# Altium project master.PrjPcb (part 2 of 4)

## Sheet analog_supply_decoupling.SchDoc
size A3; DocumentNumber: 7; SheetNumber: 7; SheetTotal: 24; SheetDescription: Analog Supply Decoupling
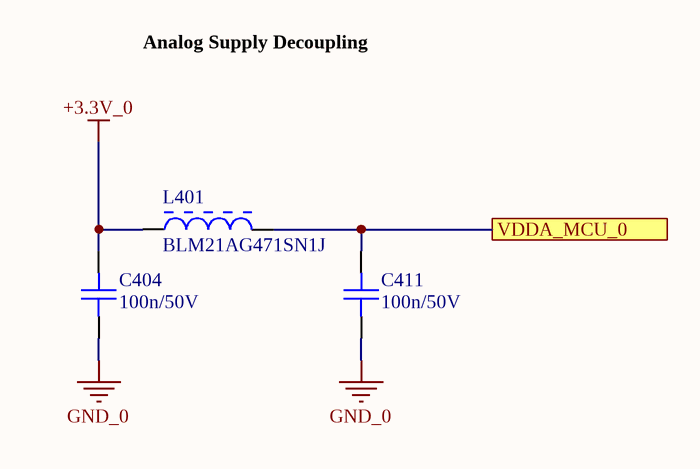
[diagram p10: analog_supply_decoupling.SchDoc]

### Parts
C404  100n/50V  [CAPC1608X08N]
C411  100n/50V  [CAPC1608X08N]
L401  BLM21AG471SN1J  [MURA-BLM21-H1-CHIP-2_V]

### Ports
VDDA_MCU_0

### Nets
+3.3V_0: C404.1 L401.1
GND_0: C404.2 C411.2
VDDA_MCU_0: C411.1 L401.2 ; port VDDA_MCU_0

### Notes on the sheet
- Analog Supply Decoupling
- Fraunhofer IISB
- Schottkystr. 10
- developed by:
- 91058 Erlangen
- Germany
- Author
- Project
- License
- Description
- File
- Version
- Release Date
- Sheet
- www.foxbms.org
- www.iisb.fraunhofer.de
- foxBMS Team
- /

### Library data of the parts
C404 C411 = gen_C_ceramic_100n_50V_X7R_0603: as C2101 on sheet FPGA_SPI_interface; Part Number: gen_C_ceramic_100n_50V_X7R_0603; Supplier 1: Farnell; Supplier Part Number 1: 2525267; Supplier 2: Digikey; Supplier Part Number 2: 490-6049-1-ND
L401 = CMP-0686-00649-2: Chip Ferrite Bead for General Signal lines, 470 Ohm, 700 mA, -55 to 125 degC, 2 x 1.25 x 1.05 mm SMD, Tape and Reel; Manufacturer: Murata; DC Resistance: 0.19 Ohm Max.; Impedance (at 100 MHz): 470 Ohm +/- 25%; Rated Current: 700 mA; ComponentLink1URL: http://www.murata.com/; Packing: Tape and Reel; PackageDescription: 2-Pin Chip, Body 2 x 1.25 mm; ComponentLink3Description: Package Specification; Operating Temperature Range: -55 to 125 degC; ComponentLink1Description: Manufacturer URL; PartNumber: BLM21AG471SN1J; DatasheetVersion: 08/2013; Mounting Technology: Surface Mount; ComponentLink2URL: http://www.murata.com/products/catalog/pdf/c31e.pdf; ComponentLink3URL: http://www.murata.com/products/catalog/pdf/c31e.pdf; ComponentLink2Description: Datasheet; PackageReference: BLM21_H1050-2

## Sheet SDRAM.SchDoc: foxBMS BMS-Master
size A3; DocumentNumber: 22; SheetNumber: 22; SheetTotal: 24; Author: Fraunhofer IISB foxBMS Team; REL-DATE: 2017-05-16; VERSION: 1.0.2; SheetDescription: 8MB SDRAM
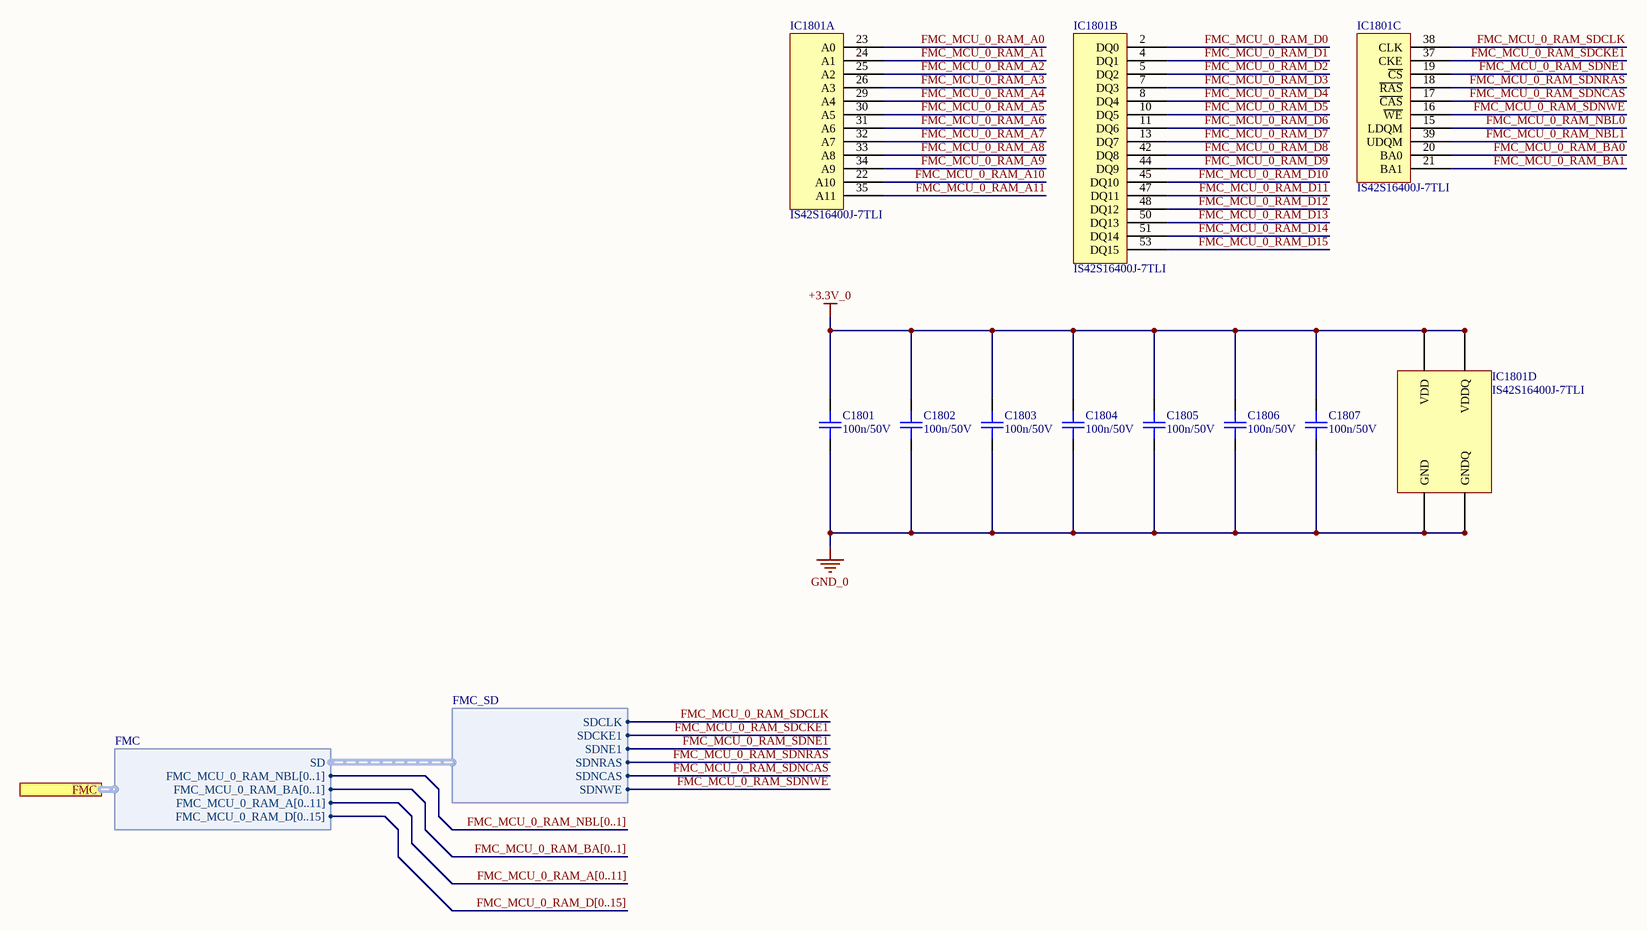
[diagram p11: SDRAM.SchDoc]

### Parts
C1801  100n/50V  [CAPC1608X08N]
C1802  100n/50V  [CAPC1608X08N]
C1803  100n/50V  [CAPC1608X08N]
C1804  100n/50V  [CAPC1608X08N]
C1805  100n/50V  [CAPC1608X08N]
C1806  100n/50V  [CAPC1608X08N]
C1807  100n/50V  [CAPC1608X08N]
IC1801  IS42S16400J-7TLI  [TSOP80P1180X120-54N]  (parts A,B,C,D of 4)

### Ports
FMC (harness FMC)

### Harnesses
FMC_SD: SDCLK, SDCKE1, SDNE1, SDNRAS, SDNWE, SDNCAS
FMC: SD, FMC_MCU_0_RAM_NBL[0..1], FMC_MCU_0_RAM_BA[0..1], FMC_MCU_0_RAM_A[0..11], FMC_MCU_0_RAM_D[0..15]

### Nets
+3.3V_0: C1801.1 C1802.1 C1803.1 C1804.1 C1805.1 C1806.1 C1807.1 IC1801.1(VDD) IC1801.3(VDDQ) IC1801.9(VDDQ) IC1801.14(VDD) IC1801.27(VDD) IC1801.43(VDDQ) IC1801.49(VDDQ)
GND_0: C1801.2 C1802.2 C1803.2 C1804.2 C1805.2 C1806.2 C1807.2 IC1801.6(GNDQ) IC1801.12(GNDQ) IC1801.28(GND) IC1801.41(GND) IC1801.46(GNDQ) IC1801.52(GNDQ) IC1801.54(GND)
FMC_MCU_0_RAM_A0: IC1801.23(A0)
FMC_MCU_0_RAM_A1: IC1801.24(A1)
FMC_MCU_0_RAM_A2: IC1801.25(A2)
FMC_MCU_0_RAM_A3: IC1801.26(A3)
FMC_MCU_0_RAM_A4: IC1801.29(A4)
FMC_MCU_0_RAM_A5: IC1801.30(A5)
FMC_MCU_0_RAM_A6: IC1801.31(A6)
FMC_MCU_0_RAM_A7: IC1801.32(A7)
FMC_MCU_0_RAM_A8: IC1801.33(A8)
FMC_MCU_0_RAM_A9: IC1801.34(A9)
FMC_MCU_0_RAM_A10: IC1801.22(A10)
FMC_MCU_0_RAM_A11: IC1801.35(A11)
FMC_MCU_0_RAM_BA0: IC1801.20(BA0)
FMC_MCU_0_RAM_BA1: IC1801.21(BA1)
FMC_MCU_0_RAM_D0: IC1801.2(DQ0)
FMC_MCU_0_RAM_D1: IC1801.4(DQ1)
FMC_MCU_0_RAM_D2: IC1801.5(DQ2)
FMC_MCU_0_RAM_D3: IC1801.7(DQ3)
FMC_MCU_0_RAM_D4: IC1801.8(DQ4)
FMC_MCU_0_RAM_D5: IC1801.10(DQ5)
FMC_MCU_0_RAM_D6: IC1801.11(DQ6)
FMC_MCU_0_RAM_D7: IC1801.13(DQ7)
FMC_MCU_0_RAM_D8: IC1801.42(DQ8)
FMC_MCU_0_RAM_D9: IC1801.44(DQ9)
FMC_MCU_0_RAM_D10: IC1801.45(DQ10)
FMC_MCU_0_RAM_D11: IC1801.47(DQ11)
FMC_MCU_0_RAM_D12: IC1801.48(DQ12)
FMC_MCU_0_RAM_D13: IC1801.50(DQ13)
FMC_MCU_0_RAM_D14: IC1801.51(DQ14)
FMC_MCU_0_RAM_D15: IC1801.53(DQ15)
FMC_MCU_0_RAM_NBL0: IC1801.15(LDQM)
FMC_MCU_0_RAM_NBL1: IC1801.39(UDQM)
FMC_MCU_0_RAM_SDCKE1: IC1801.37(CKE) ; harness FMC_SD.SDCKE1
FMC_MCU_0_RAM_SDCLK: IC1801.38(CLK) ; harness FMC_SD.SDCLK
FMC_MCU_0_RAM_SDNCAS: IC1801.17(~{CAS}) ; harness FMC_SD.SDNCAS
FMC_MCU_0_RAM_SDNE1: IC1801.19(~{CS}) ; harness FMC_SD.SDNE1
FMC_MCU_0_RAM_SDNRAS: IC1801.18(~{RAS}) ; harness FMC_SD.SDNRAS
FMC_MCU_0_RAM_SDNWE: IC1801.16(~{WE}) ; harness FMC_SD.SDNWE

### Buses and harness runs
bus FMC_MCU_0_RAM_A[0..11]
bus FMC_MCU_0_RAM_BA[0..1]
bus FMC_MCU_0_RAM_D[0..15]
bus FMC_MCU_0_RAM_NBL[0..1]

### Notes on the sheet
- Fraunhofer IISB
- Schottkystr. 10
- developed by:
- 91058 Erlangen
- Germany
- Author
- Project
- License
- Description
- File
- Version
- Release Date
- Sheet
- www.foxbms.org
- www.iisb.fraunhofer.de
- foxBMS Team
- /

### Library data of the parts
C1801-C1807 = gen_C_ceramic_100n_50V_X7R_0603: as C2101 on sheet FPGA_SPI_interface; Part Number: gen_C_ceramic_100n_50V_X7R_0603; Supplier 1: Farnell; Supplier Part Number 1: 2525267; Supplier 2: Digikey; Supplier Part Number 2: 490-6049-1-ND
IC1801 = IS42S16400J-7TLI: SDRAM, 4M x 16 Bit; Manufacturer: INTEGRATED SILICON SOLUTION (ISSI); PnP Package: TSOP II; Automotive Qualified: True; Part Number: IS42S16400J-7TLI; Part Name: IS42S16400J-7TLI; Operating Temperature: -40 / o / C to +85 / o / -40°C - +85°C; ComponentLink1Description: Datasheet; ComponentLink1URL: http://www.farnell.com/datasheets/1674895.pdf; Supplier 1: Farnell; Supplier Part Number 1: 2253831

## Sheet CAN0.SchDoc: foxBMS BMS-Master
size A3; DocumentNumber: 14; SheetNumber: 14; SheetTotal: 24; Author: Fraunhofer IISB foxBMS Team; REL-DATE: 2017-05-16; VERSION: 1.0.2; SheetDescription: CAN0 Interface for MCU0
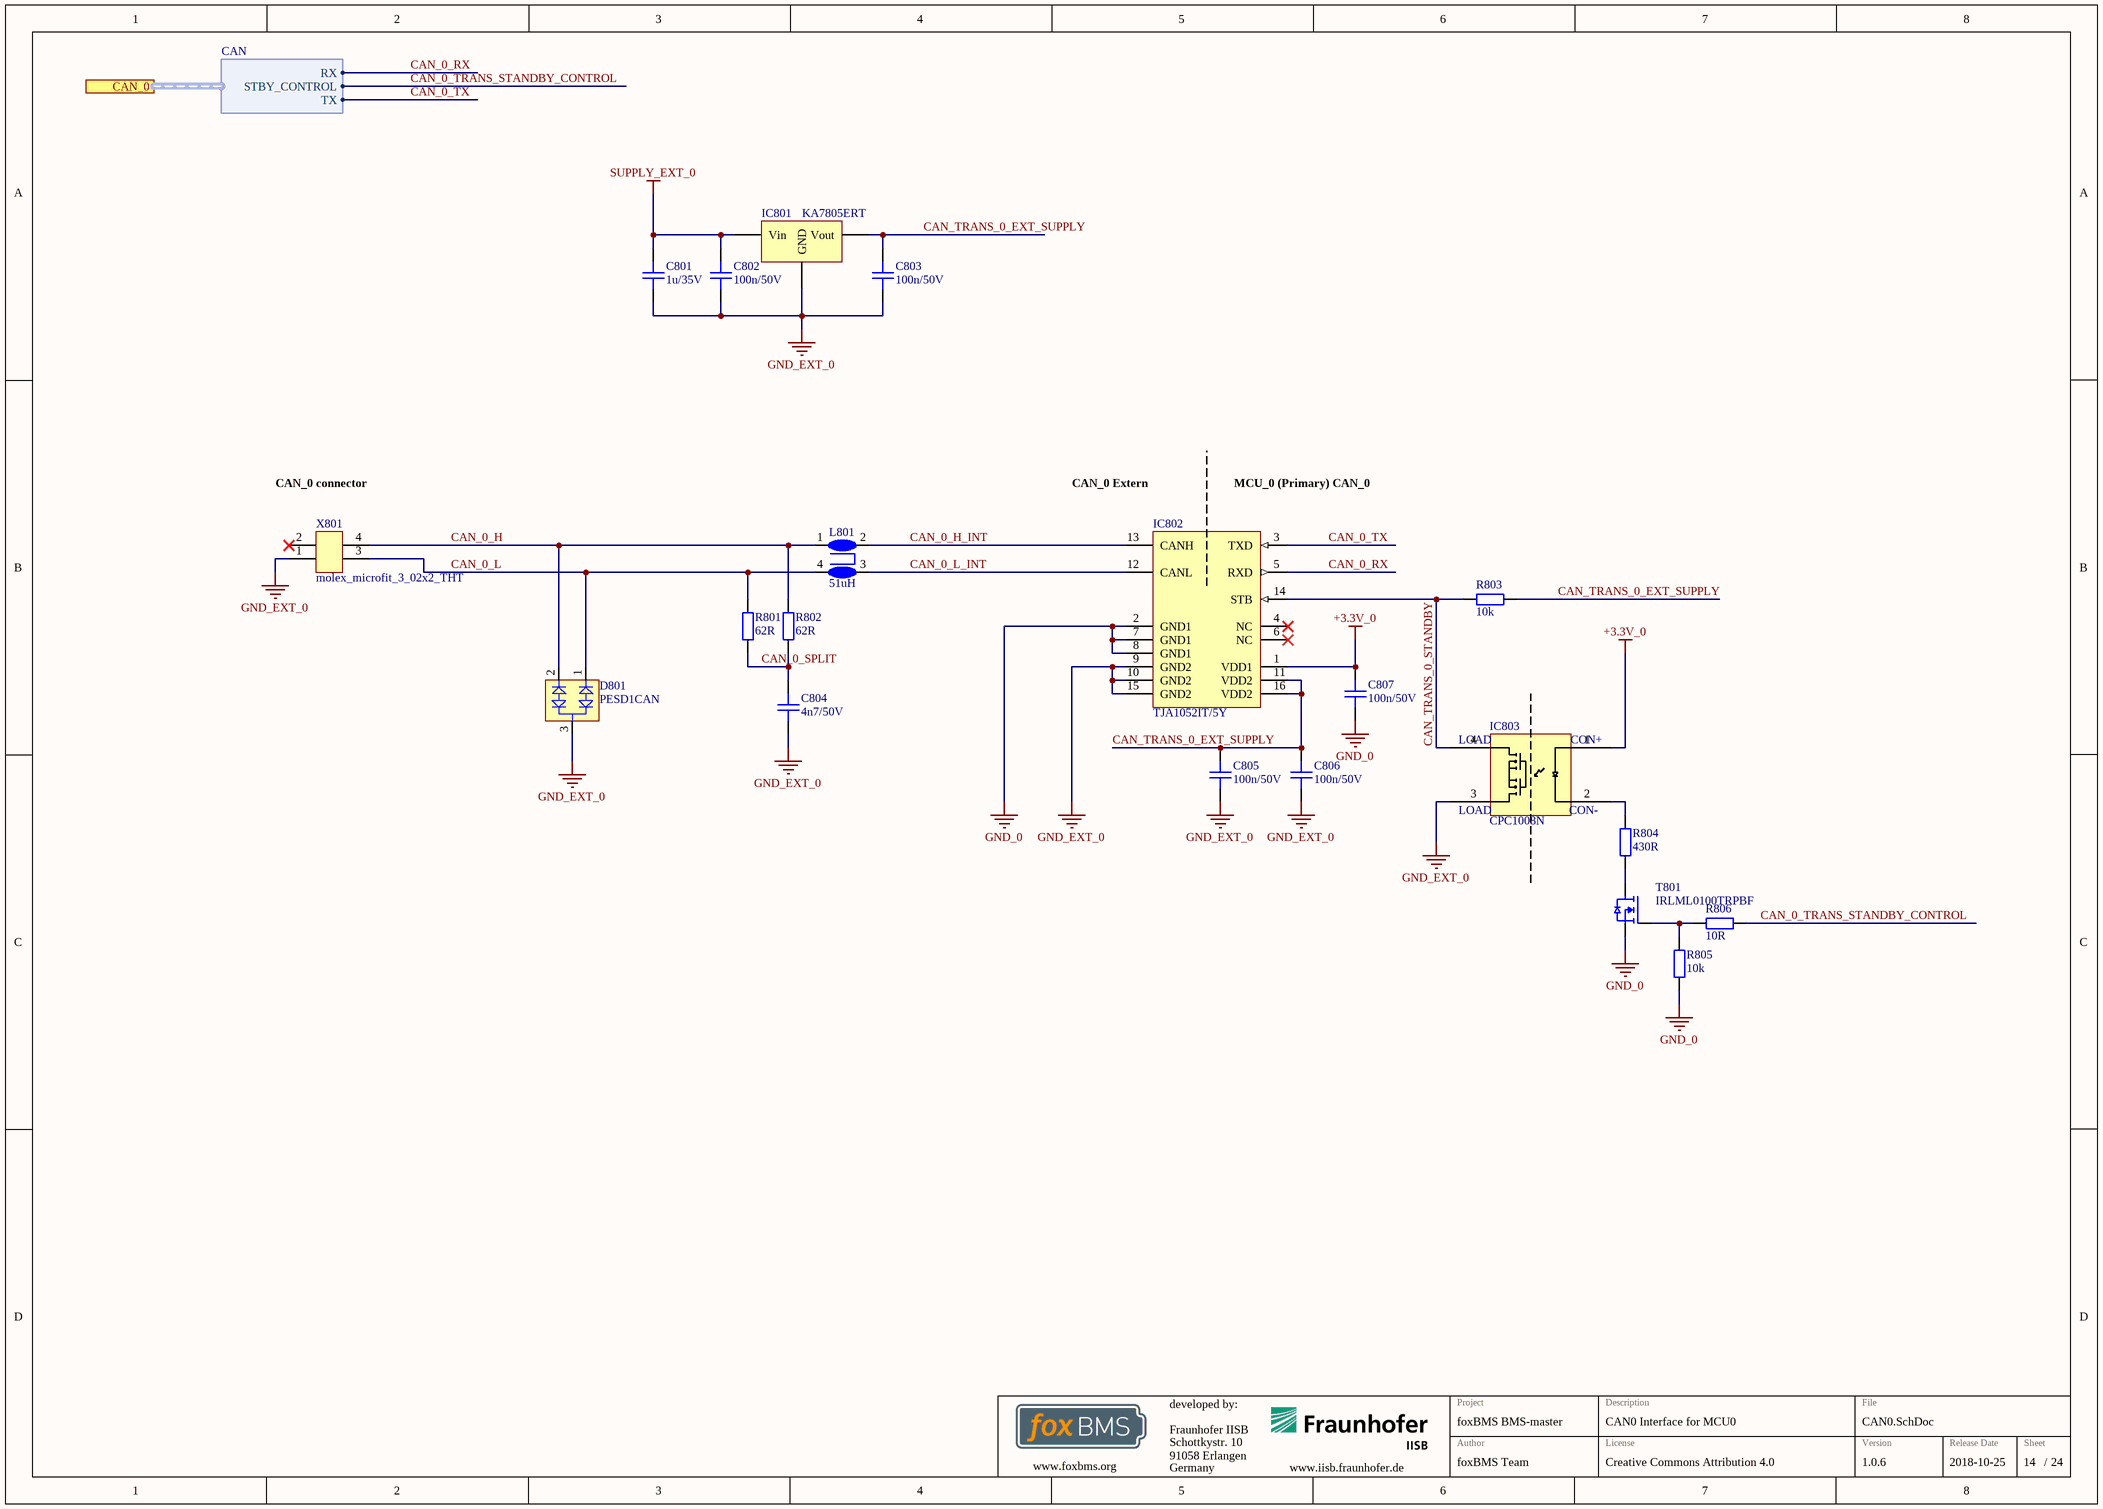
[diagram p12: CAN0.SchDoc]

### Parts
C801  1u/35V  [CAPC1608X08N]
C802  100n/50V  [CAPC1608X08N]
C803  100n/50V  [CAPC1608X08N]
C804  4n7/50V  [CAPC1608X08N]
C805  100n/50V  [CAPC1608X08N]
C806  100n/50V  [CAPC1608X08N]
C807  100n/50V  [CAPC1608X08N]
D801  PESD1CAN  [NXP-SOT23-3_V]
IC801  KA7805ERT  [DPAK228P950X240-3N]
IC802  TJA1052IT/5Y  [NXP-SOIC-16_L]
IC803  CPC1008N  [SOP254P610X218-4N]
L801  51uH  [B82789C0/S0]
R801  62R  [RESC1608X05N]
R802  62R  [RESC1608X05N]
R803  10k  [RESC1608X05N]
R804  430R  [RESC1608X05N]
R805  10k  [RESC1608X05N]
R806  10R  [RESC1608X05N]
T801  IRLML0100TRPBF  [SOT95P237X110-3N]
X801  molex_microfit_3_02x2_THT  [MOLEX_MICROFIT_02x2_THT]

### Ports
CAN_0 (harness CAN)

### Harnesses
CAN: RX, STBY_CONTROL, TX

### Nets
+3.3V_0: C807.2 IC802.1(VDD1) IC803.1
GND_0: C807.1 IC802.2(GND1) IC802.7(GND1) IC802.8(GND1) R805.2 T801.S
GND_EXT_0: C801.1 C802.1 C803.1 C804.2 C805.1 C806.1 D801.3(C) IC801.2(GND) IC802.9(GND2) IC802.10(GND2) IC802.15(GND2) IC803.3 X801.1
SUPPLY_EXT_0: C801.2 C802.2 IC801.1(Vin)
CAN_0_H: D801.2(K2) L801.1 R802.2 X801.4
CAN_0_H_INT: IC802.13(CANH) L801.2
CAN_0_L: D801.1(K1) L801.4 R801.1 X801.3
CAN_0_L_INT: IC802.12(CANL) L801.3
CAN_0_RX: IC802.5(RXD) ; port CAN_0.RX
CAN_0_SPLIT: C804.1 R801.2 R802.1
CAN_0_TRANS_STANDBY_CONTROL: R806.2 ; port CAN_0.STBY_CONTROL
CAN_0_TX: IC802.3(TXD) ; port CAN_0.TX
CAN_TRANS_0_EXT_SUPPLY: C803.2 C805.2 C806.2 IC801.3(Vout) IC802.11(VDD2) IC802.16(VDD2) R803.1
CAN_TRANS_0_STANDBY: IC802.14(STB) IC803.4 R803.2
NetIC803_2: IC803.2 R804.1
NetR804_2: R804.2 T801.D
NetR805_1: R805.1 R806.1 T801.G

Not connected (* = marked no-connect by the designer): IC802 4(NC)* 6(NC)*; X801 2*

### Notes on the sheet
- CAN_0 connector
- CAN_0 Extern
- MCU_0 (Primary) CAN_0
- Fraunhofer IISB
- Schottkystr. 10
- developed by:
- 91058 Erlangen
- Germany
- Author
- Project
- License
- Description
- File
- Version
- Release Date
- Sheet
- www.foxbms.org
- www.iisb.fraunhofer.de
- foxBMS Team
- /
- (in symbol CPC1008N) LOAD; CON+; CON-

### Library data of the parts
C801 = gen_C_ceramic_1u_35V_X7R_0603: MLCC; Capacitance: 1u; Rated Voltage: 35V; Dielectric: X7R; Case EIA: 0603; Case Metric: 1608; PnP Package: C_0603_10; PnP Value: 1uF/35V/X7R; PnP equipped: x; Automotive Qualified: False; Part Number: gen_C_ceramic_1u_35V_X7R_0603; Supplier 1: Farnell; Supplier Part Number 1: 1907508
C802 C803 C805-C807 = gen_C_ceramic_100n_50V_X7R_0603: as C2101 on sheet FPGA_SPI_interface; Part Number: gen_C_ceramic_100n_50V_X7R_0603; Supplier 1: Farnell; Supplier Part Number 1: 2525267; Supplier 2: Digikey; Supplier Part Number 2: 490-6049-1-ND
C804 = gen_C_ceramic_4n7_50V_X7R_0603: MLCC; Capacitance: 4n7; Rated Voltage: 50V; Dielectric: X7R; Case EIA: 0603; Case Metric: 1608; PnP Package: C_0603_05; Automotive Qualified: True; Part Number: gen_C_ceramic_4n7_50V_X7R_0603; Supplier 1: Farnell; Supplier Part Number 1: 2904754
D801 = CMP-2000-04916-1: CAN Bus ESD Protection Diode, 200 W, 24 V, -65 to 150 degC, 3-Pin SOT23, RoHS, Tape and Reel; Manufacturer: NXP Semiconductors; SVHC: NoSVHC(20-Jun-2013); Reverse Stand-Off Voltage Vrwm: 24V; Breakdown Voltage Max: 30.3V; Capacitance Cd @ Vr Typ: 11pF; TVS Polarity: Bidirectional; Peak Pulse Power: 200W; Breakdown Voltage Min: 25.4V; Clamping Voltage @ 8/20µs Max: 70V; Peak Pulse Current Ippm: 3A; SMD Marking: AN; Diode Case Style: SOT-23; Breakdown Voltage: 27.8V; Breakdown Voltage Range: 25.4Vto30.3V; Capacitance Cd @ Vr Max: 17pF; No. of Pins: 3; Diode Type: BidirectionalTVS; Termination Type: SMD; Operating Temperature Max: 150degC; Datasheet URL: https://datasheet.ciiva.com/22692/109497-22692467.pdf; Package / Case: SOT-23; Diode Configuration: Bidirectional; Operating Temperature Min: -65degC; Stand-off Voltage: 24V; Datasheet Version: Rev. 04, 02/2008; Manufacturer URL: http://www.nxp.com/; Operating Temperature Range: -65degCto+150degC; Breakover Voltage Min: 25.4V; Clamping Voltage Vc Max: 70V
IC801 = KA7805ERTF: 3-Terminal 1 A Positive Voltage Regulator; Manufacturer: Fairchild; Automotive Qualified: False; Part Number: KA7805ERTF; Part Name: KA7805ERTF; Operating Temperature: -40°C - +125°C; ComponentLink1Description: Datasheet; ComponentLink1URL: http://www.farnell.com/datasheets/2299720.pdf; Supplier 1: Farnell; Supplier Part Number 1: 2102585
IC802 = CMP-2000-07246-1: Galvanically Isolated High-Speed CAN Transceiver, -40 to 125 degC, 16-Pin SOIC, RoHS, Tape and Reel; Manufacturer: NXPSemiconductors; Rad Hard: No; Minimum Single Supply Voltage: 3; Maximum Single Supply Voltage: 5.25V; Power Down Mode: Standby; Maximum Data Rate: 1Mbps; Standard Supported: ISO11898-2; Number of Transceivers: 1; Package Description: 16-Pin Small Outline Integrated Circuit, Body 10.3 x 7.5 mm, Pitch 1.27 mm; Package: 16SOIC; Datasheet URL: http://www.nxp.com/documents/data_sheet/TJA1052I.pdf; Category: Transceiver; Manufacturer URL: http://www.nxp.com/; Datasheet Version: Rev. 3, 01/2015; Packaging: Tape&Reel; Package Reference: SOT162-1; Mounting Technology: SurfaceMount
IC803 = CPC1008N: Single-Pole, Normally Open 4-Pin SOP OptoMOS Relay; Manufacturer: CLARE; Automotive Qualified: False; ComponentLink1Description: Datasheet; Part Number: CPC1008N; Operating Temperature: -40°C - +85°C; ComponentLink1URL: http://www.farnell.com/datasheets/1924621.pdf; Supplier 1: Farnell; Supplier Part Number 1: 1653755; Part Name: CPC1008N
L801 = B82789N: Common Mode Choke; Manufacturer: EPCOS / TDK; Rated Current: 250mA; Automotive Qualified: False; Part Number: B82789N; Operating Temperature: -55°C - +150°C; ComponentLink1Description: Datasheet; ComponentLink1URL: https://www.mouser.com/ds/2/400/b82789c0_s0-1220172.pdf; Inductance: 51uH; Supplier 1: Mouser; Supplier Part Number 1: 871-B82789C0513H002
R801 R802 = gen_R_62R_0603: SMD Resistor 62R 0603; Tolerance: 1%; Power: 0.1W; Case EIA: 0603; Case Metric: 1608; Maximum Working Voltage: 75V; PnP Package: R_0603; Automotive Qualified: False; Part Number: gen_R_62R_0603; Operating Temperature: -55°C - +155°C; Resistance: 62R; Series: E24; PnP Value: 62R; Supplier 1: Farnell; Supplier Part Number 1: 2073943
R803 R805 = gen_R_10k_0603: as R405 on sheet mcu0_primary; Part Number: gen_R_10k_0603; Operating Temperature: -55°C - +155°C; Resistance: 10k; Series: E24, E96; PnP Value: 10k; Supplier 1: Farnell; Supplier Part Number 1: 2073349
R804 = gen_R_430R_0603: SMD Resistor 430R 0603; Tolerance: 1%; Power: 0.1W; Case EIA: 0603; Case Metric: 1608; Maximum Working Voltage: 75V; PnP Package: R_0603; Automotive Qualified: False; Part Number: gen_R_430R_0603; Operating Temperature: -55°C - +155°C; Resistance: 430R; Series: E24; PnP Value: 430R; Supplier 1: Farnell; Supplier Part Number 1: 2074259
R806 = gen_R_10R_0603: SMD Resistor 10R 0603; Tolerance: 1%; Power: 0.1W; Case EIA: 0603; Case Metric: 1608; Maximum Working Voltage: 75V; PnP Package: R_0603; Automotive Qualified: False; Part Number: gen_R_10R_0603; Operating Temperature: -55°C - +155°C; Resistance: 10R; Series: E24, E96; PnP Value: 10R; Supplier 1: Farnell; Supplier Part Number 1: 2073361
T801 = IRLML0100TRPBF: MOSFET-Transistor, n-Kanal, 1.6 A, 100 V, 0.178 ohm, 10 V, 2.5 V; Manufacturer: Infineon; Maximum Drain-Source Voltage: 100V; Maximum Continous Drain Current (25°C): 1.6A; R_DS(on): 190m; Total Gate Charge: 2.5nC; Automotive Qualified: False; Part Number: IRLML0100TRPBF; Part Name: NMOS; Operating Temperature: -55°C - +150°C; ComponentLink1Description: Datasheet URL; ComponentLink1URL: http://www.farnell.com/datasheets/491501.pdf; Supplier 1: Farnell; Supplier Part Number 1: 1783928
X801 = molex_microfit_3_02x2_THT: Micro-Fit 3.0 Right Angle Header, 3.00mm Pitch, Dual Row, 4 Circuits, with Snap-in Plastic Peg PCB Lock, Tin, Glow Wire Capable, Black, 43045-0400; Manufacturer: Molex; Circuits: 4; Rated Voltage: 600V; Rated Current: 8.5A; Automotive Qualified: False; Part Number: molex_microfit_3_02x2_THT; Part Name: MicroFit; Operating Temperature: -40°C - +105°C; Supplier 1: Farnell; Supplier Part Number 1: 9733019

## Sheet mcu0_to_mcu1_isolated_SPI.SchDoc: foxBMS BMS-Master
size A3; DocumentNumber: 12; SheetNumber: 12; SheetTotal: 24; Author: Fraunhofer IISB foxBMS Team; REL-DATE: 2017-05-16; VERSION: 1.0.2; SheetDescription: Isolated Bidirectional Interface MCU0/MCU1
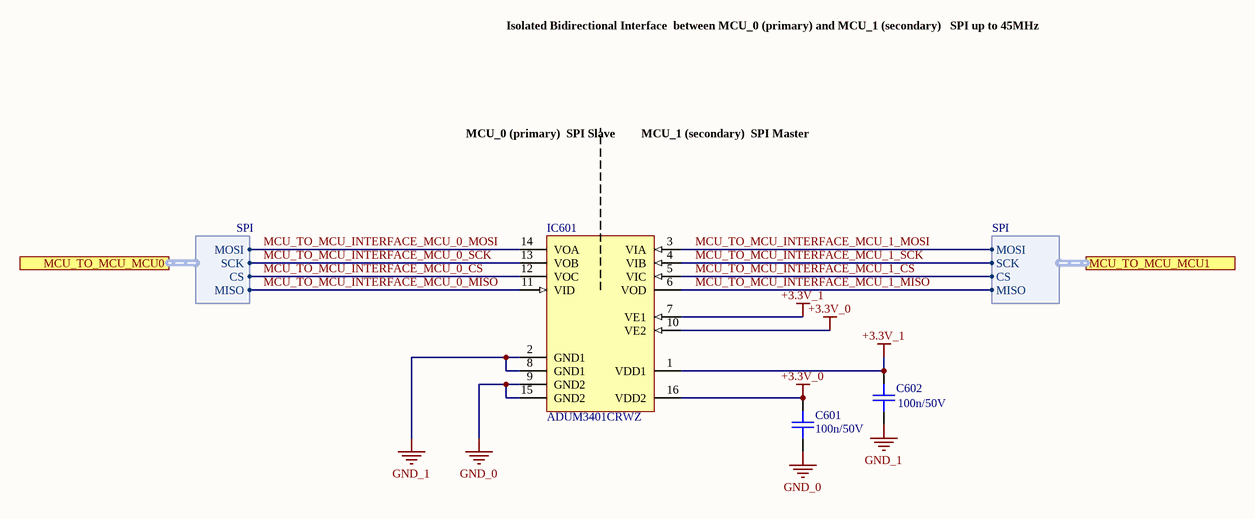
[diagram p13: mcu0_to_mcu1_isolated_SPI.SchDoc]

### Parts
C601  100n/50V  [CAPC1608X08N]
C602  100n/50V  [CAPC1608X08N]
IC601  ADUM3401CRWZ  [ADI-RW-16_N]

### Ports
MCU_TO_MCU_MCU0 (harness SPI), MCU_TO_MCU_MCU1 (harness SPI)

### Harnesses
SPI: CS, MISO, MOSI, SCK

### Nets
+3.3V_0: C601.2 IC601.10(VE2) IC601.16(VDD2)
+3.3V_1: C602.1 IC601.1(VDD1) IC601.7(VE1)
GND_0: C601.1 IC601.9(GND2) IC601.15(GND2)
GND_1: C602.2 IC601.2(GND1) IC601.8(GND1)
MCU_TO_MCU_INTERFACE_MCU_0_CS: IC601.12(VOC) ; port MCU_TO_MCU_MCU0.CS
MCU_TO_MCU_INTERFACE_MCU_0_MISO: IC601.11(VID) ; port MCU_TO_MCU_MCU0.MISO
MCU_TO_MCU_INTERFACE_MCU_0_MOSI: IC601.14(VOA) ; port MCU_TO_MCU_MCU0.MOSI
MCU_TO_MCU_INTERFACE_MCU_0_SCK: IC601.13(VOB) ; port MCU_TO_MCU_MCU0.SCK
MCU_TO_MCU_INTERFACE_MCU_1_CS: IC601.5(VIC) ; port MCU_TO_MCU_MCU1.CS
MCU_TO_MCU_INTERFACE_MCU_1_MISO: IC601.6(VOD) ; port MCU_TO_MCU_MCU1.MISO
MCU_TO_MCU_INTERFACE_MCU_1_MOSI: IC601.3(VIA) ; port MCU_TO_MCU_MCU1.MOSI
MCU_TO_MCU_INTERFACE_MCU_1_SCK: IC601.4(VIB) ; port MCU_TO_MCU_MCU1.SCK

### Notes on the sheet
- Isolated Bidirectional Interface
  between MCU_0 (primary) and MCU_1 (secondary)
  SPI up to 45MHz
- MCU_0 (primary)
  SPI Slave
- MCU_1 (secondary)
  SPI Master
- Fraunhofer IISB
- Schottkystr. 10
- developed by:
- 91058 Erlangen
- Germany
- Author
- Project
- License
- Description
- File
- Version
- Release Date
- Sheet
- www.foxbms.org
- www.iisb.fraunhofer.de
- foxBMS Team
- /

### Library data of the parts
C601 C602 = gen_C_ceramic_100n_50V_X7R_0603: as C2101 on sheet FPGA_SPI_interface; Part Number: gen_C_ceramic_100n_50V_X7R_0603; Supplier 1: Farnell; Supplier Part Number 1: 2525267; Supplier 2: Digikey; Supplier Part Number 2: 490-6049-1-ND
IC601 = CMP-0534-00405-1: Quad Channel Digital Isolator, Enhanced System-Level ESD Reliability, 2.5 KV rms Insulation Rating, 90 Mbps Data Rate, 32 ns Delay, Industrial, 16-pin SOIC (RW-16), Tube; Manufacturer: Analog Devices; Insulation Rating (kVrms): 2.5; Max Data Rate: 90Mbps; PackageDescription: 16-Pin Standard Small Outline Package, Body 10.3 x 7.5 mm, Pitch 1.27 mm; ComponentLink2Description: Datasheet; Mounting Technology: Surface Mount; ComponentLink2URL: http://www.analog.com/static/imported-files/data_sheets/ADUM3400_3401_3402.pdf; ComponentLink4URL: Product URL:http://www.analog.com/en/interface-isolation/digital-isolators/adum3401/products/product.html; ComponentLink1URL: http://www.analog.com/en/index.html; ComponentLink1Description: Manufacturer URL; Max Operating Temp (degreesC): 105; PartNumber: ADUM3401CRWZ; Code_JEDEC: MS-013-AA; PackageVersion: 032707-B, 03/2007; ComponentLink3URL: http://www.analog.com/static/imported-files/packages/PKG_PDF/SOIC_WIDE%20%28RW%29/RW_16.pdf; DatasheetVersion: Rev. B; PackageReference: RW-16; ComponentLink4Description: URL Link1; ComponentLink3Description: Package Specification

## Sheet bender_isometer_interface.SchDoc: foxBMS BMS-Master
size A3; DocumentNumber: 13; SheetNumber: 13; SheetTotal: 24; Author: Fraunhofer IISB foxBMS Team; REL-DATE: 2017-05-16; VERSION: 1.0.2; SheetDescription: Bender Isometer Interface
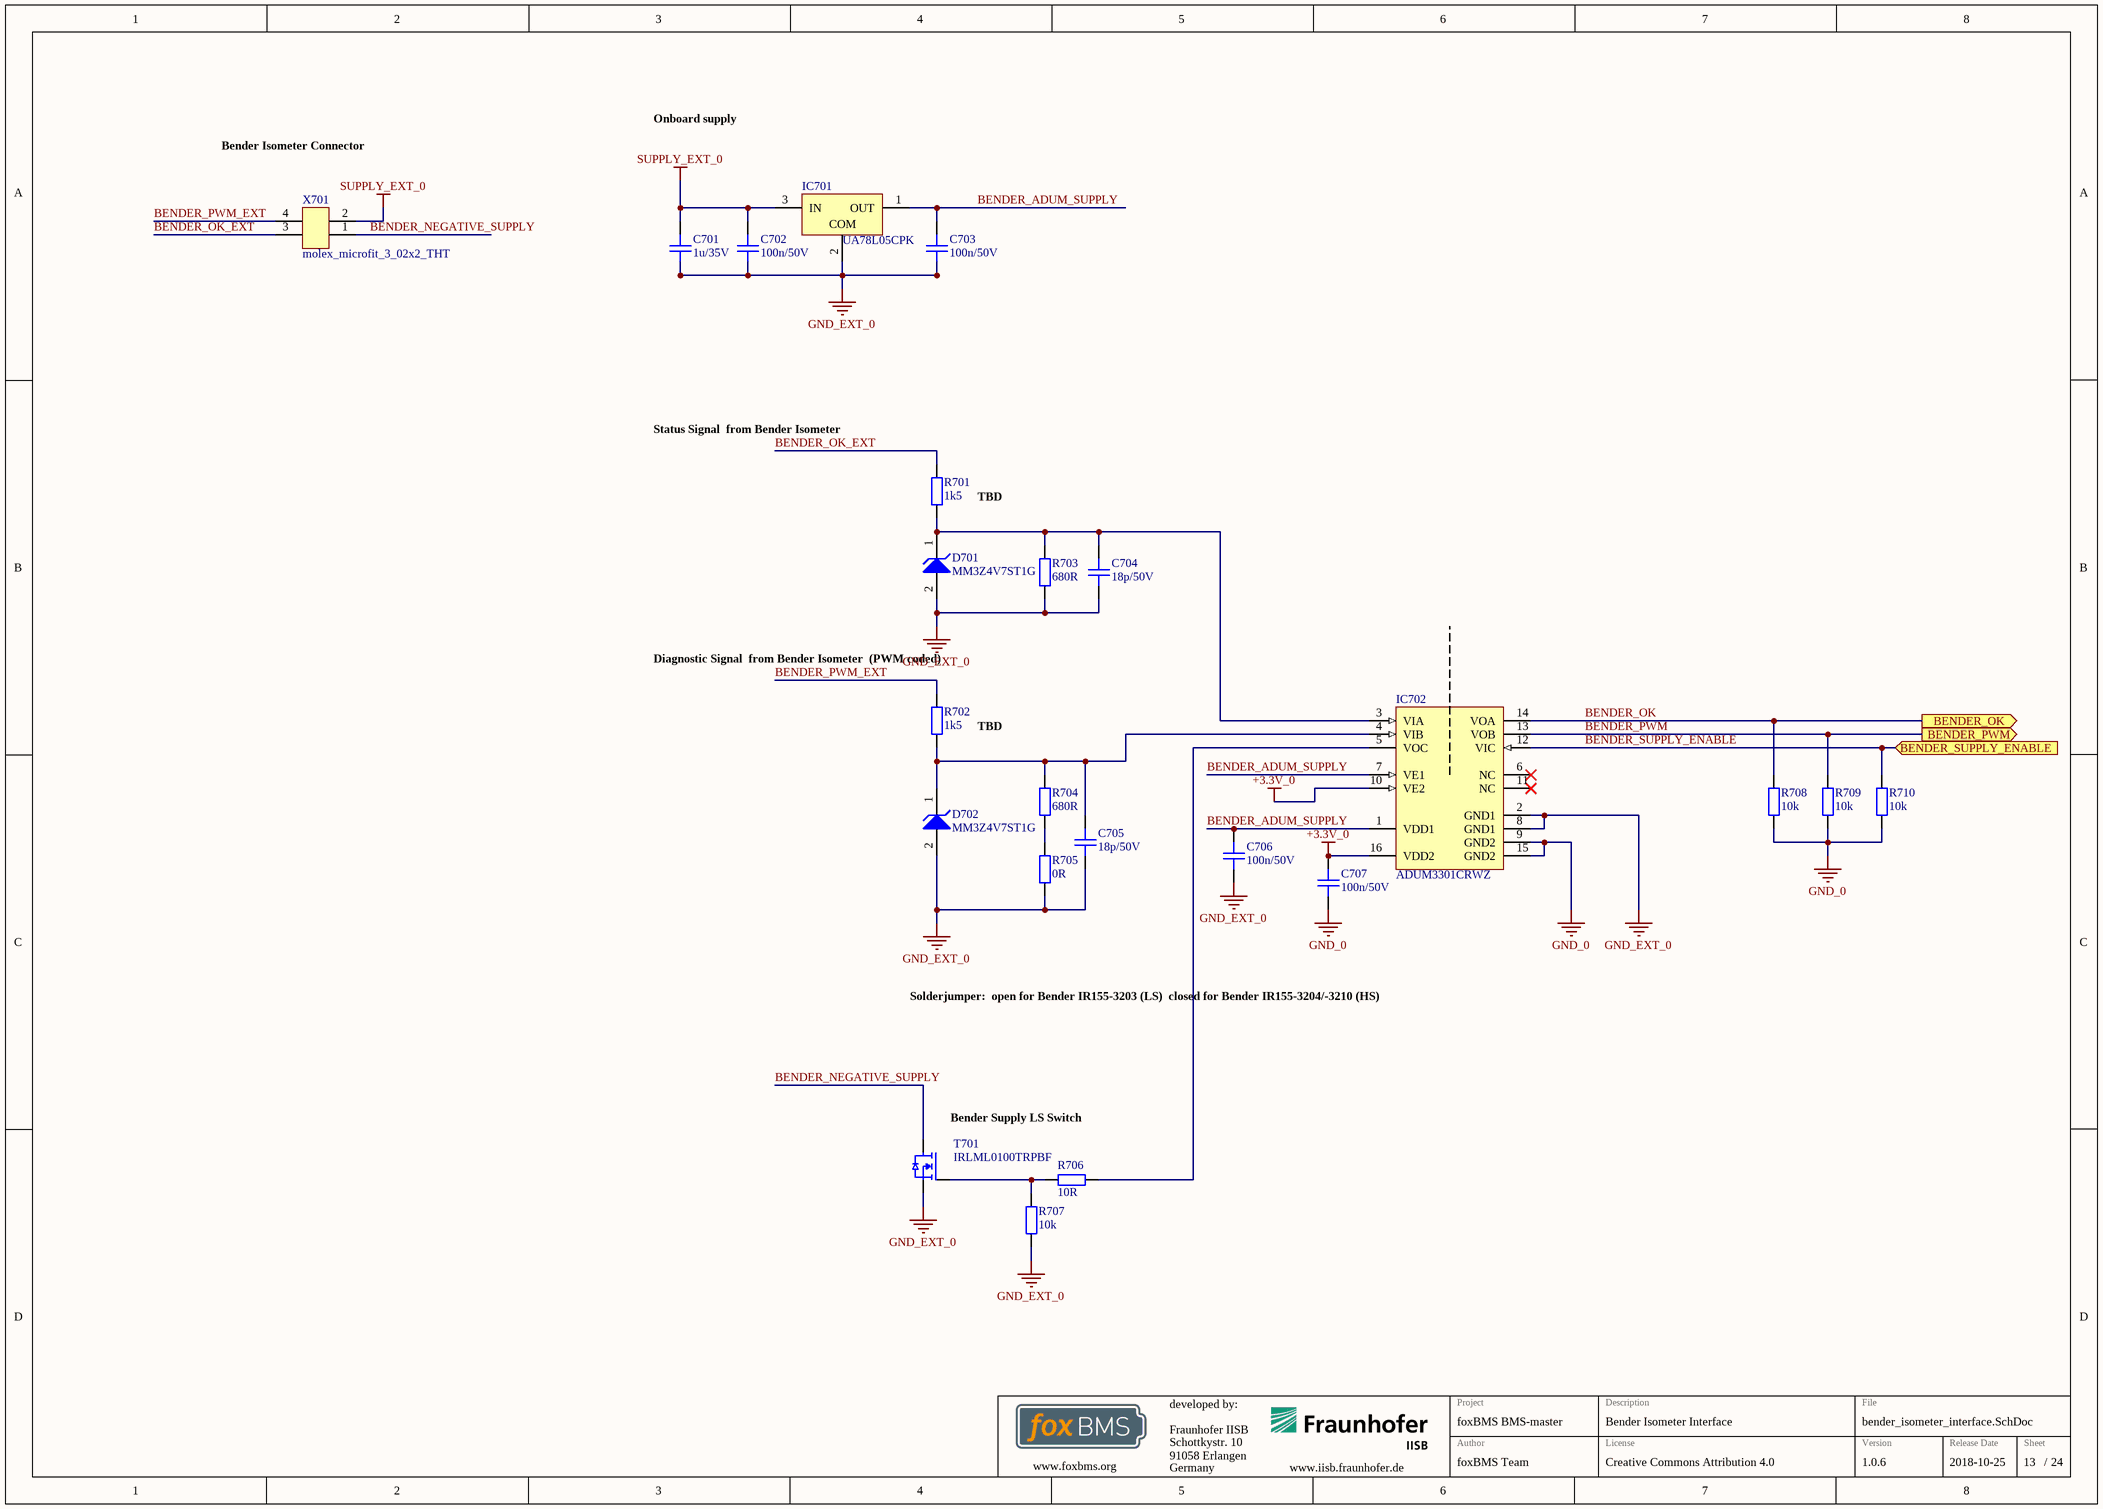
[diagram p14: bender_isometer_interface.SchDoc]

### Parts
C701  1u/35V  [CAPC1608X08N]
C702  100n/50V  [CAPC1608X08N]
C703  100n/50V  [CAPC1608X08N]
C704  18p/50V  [CAPC1608X08N]
C705  18p/50V  [CAPC1608X08N]
C706  100n/50V  [CAPC1608X08N]
C707  100n/50V  [CAPC1608X08N]
D701  MM3Z4V7ST1G  [ONSC-SOD-323-2-477-02_V]
D702  MM3Z4V7ST1G  [ONSC-SOD-323-2-477-02_V]
IC701  UA78L05CPK  [PK0003A_L]
IC702  ADUM3301CRWZ  [ADI-RW-16_N]
R701  1k5  [RESC1608X05N]
R702  1k5  [RESC1608X05N]
R703  680R  [RESC1608X05N]
R704  680R  [RESC1608X05N]
R705  0R  [RESC1608X05N]
R706  10R  [RESC1608X05N]
R707  10k  [RESC1608X05N]
R708  10k  [RESC1608X05N]
R709  10k  [RESC1608X05N]
R710  10k  [RESC1608X05N]
T701  IRLML0100TRPBF  [SOT95P237X110-3N]
X701  molex_microfit_3_02x2_THT  [MOLEX_MICROFIT_02x2_THT]

### Ports
BENDER_OK (out), BENDER_PWM (out), BENDER_SUPPLY_ENABLE (in)

### Nets
+3.3V_0: C707.1 IC702.10(VE2) IC702.16(VDD2)
GND_0: C707.2 IC702.9(GND2) IC702.15(GND2) R708.1 R709.1 R710.1
GND_EXT_0: C701.2 C702.2 C703.2 C704.2 C705.2 C706.2 D701.2(A) D702.2(A) IC701.2(COM) IC702.2(GND1) IC702.8(GND1) R703.1 R705.1 R707.2 T701.S
SUPPLY_EXT_0: C701.1 C702.1 IC701.3(IN) X701.2
BENDER_ADUM_SUPPLY: C703.1 C706.1 IC701.1(OUT) IC702.1(VDD1) IC702.7(VE1)
BENDER_NEGATIVE_SUPPLY: T701.D X701.1
BENDER_OK: IC702.14(VOA) R708.2 ; port BENDER_OK
BENDER_OK_EXT: R701.2 X701.3
BENDER_PWM: IC702.13(VOB) R709.2 ; port BENDER_PWM
BENDER_PWM_EXT: R702.2 X701.4
BENDER_SUPPLY_ENABLE: IC702.12(VIC) R710.2 ; port BENDER_SUPPLY_ENABLE
NetC704_1: C704.1 D701.1(K) IC702.3(VIA) R701.1 R703.2
NetC705_1: C705.1 D702.1(K) IC702.4(VIB) R702.1 R704.2
NetIC702_5: IC702.5(VOC) R706.1
NetR704_1: R704.1 R705.2
NetR706_2: R706.2 R707.1 T701.G

Not connected (* = marked no-connect by the designer): IC702 6(NC)* 11(NC)*

### Notes on the sheet
- Bender Isometer Connector
- Onboard supply
- Status Signal
  from Bender Isometer
- (near R701) TBD
- (near R702) Diagnostic Signal
  from Bender Isometer
  (PWM coded)
- (near R702) TBD
- Solderjumper:
  open for Bender IR155-3203 (LS)
  closed for Bender IR155-3204/-3210 (HS)
- (near T701) Bender Supply LS Switch
- Fraunhofer IISB
- Schottkystr. 10
- developed by:
- 91058 Erlangen
- Germany
- Author
- Project
- License
- Description
- File
- Version
- Release Date
- Sheet
- www.foxbms.org
- www.iisb.fraunhofer.de
- foxBMS Team
- /

### Library data of the parts
C701 = gen_C_ceramic_1u_35V_X7R_0603: as C801 on sheet CAN0; Part Number: gen_C_ceramic_1u_35V_X7R_0603; Supplier 1: Farnell; Supplier Part Number 1: 1907508
C702 C703 C706 C707 = gen_C_ceramic_100n_50V_X7R_0603: as C2101 on sheet FPGA_SPI_interface; Part Number: gen_C_ceramic_100n_50V_X7R_0603; Supplier 1: Farnell; Supplier Part Number 1: 2525267; Supplier 2: Digikey; Supplier Part Number 2: 490-6049-1-ND
C704 C705 = gen_C_ceramic_18p_50V_C0G_0603: as C402 on sheet crystals; Part Number: gen_C_ceramic_18p_50V_C0G_0603; Supplier 1: Farnell; Supplier Part Number 1: 2070403
D701 D702 = CMP-1060-00697-1: Zener Voltage Regulator, 300 mW, Tight Tolerance Portfolio, 2-Pin SOD-323, Pb-Free, Tape and Reel; Manufacturer: On Semiconductor; P Max (W): 0.3; ComponentLink2Description: Datasheet; PackageDescription: 2-Pin SOD, Body 1.7 x 1.25 mm; PartNumber: MM3Z4V7ST1G; ComponentLink2URL: http://www.onsemi.cn/pub_link/Collateral/MM3Z2V4ST1-D.PDF; ComponentLink1Description: Manufacturer URL; DatasheetVersion: Rev. 21; PackageReference: SOD-323-2-477-02; ComponentLink3URL: http://www.onsemi.com/pub_link/Collateral/477-02.PDF.1; RoHS: Pb-Free; ComponentLink3Description: Package Specification; ComponentLink1URL: http://www.onsemi.com/; Packing: Tape and Reel; Mounting Technology: Surface Mount; PackageVersion: Rev. H, 03/2007
IC701 = CMP-2000-07341-1: Positive-Voltage Regulator, 100 mA, 0 to 125 degC, 3-Pin SOT-89 (PK), Green (RoHS & no Sb/Br), Tape and Reel; Manufacturer: TexasInstruments; Load Regulation: 60mV; Input Voltage MIN: 7V; Number of Outputs: 1; Input Voltage MAX: 20V; Output Type: Fixed; Output Current: 100mA; Output Voltage: 5V; PSRR / Ripple Rejection - Typ: 49dB; Line Regulation: 200mV; Mounting Style: SMD/SMT; Datasheet Version: Rev. U, 05/2011; Polarity: Positive; Minimum Operating Temperature: 0C; Package Reference: PK0003A; Brand: TexasInstruments; Packaging: Reel; Product Category: LinearVoltageRegulators; RoHS: True; Datasheet URL: http://www.ti.com/lit/ds/symlink/ua78l05.pdf; Package URL: http://www.ti.com/lit/ml/mhsi001b/mhsi001b.pdf; Series: UA78L05; Manufacturer URL: http://www.ti.com/; Package Description: 3-Pin Small Outline Transistor, Body 4.5 x 2.5 mm, Pitch 1.5 mm; Mounting Technology: SurfaceMount; Package / Case: SOT-89-4; Maximum Operating Temperature: +125C
IC702 = CMP-0534-00610-1: Triple Channel Digital Isolator, Enhanced System-Level ESD Reliability, 2.5 KV rms Insulation Rating, 90 Mbps Data Rate, 32 ns Delay, Industrial, 16-pin SOIC (RW-16), Tube; Manufacturer: Analog Devices; Insulation Rating (kVrms): 2.5; Max Data Rate: 90Mbps; PackageVersion: 032707-B, 03/2007; PartNumber: ADUM3301CRWZ; PackageDescription: 16-Pin Standard Small Outline Package, Body 10.3 x 7.5 mm, Pitch 1.27 mm; Max Operating Temp (degreesC): 105; PackageReference: RW-16; Code_JEDEC: MS-013-AA; ComponentLink1URL: http://www.analog.com/en/index.html; ComponentLink2URL: http://www.analog.com/static/imported-files/data_sheets/ADUM3300_3301.pdf; ComponentLink1Description: Manufacturer URL; ComponentLink4URL: Product URL:http://www.analog.com/en/interface-isolation/digital-isolators/adum3301/products/product.html; ComponentLink4Description: URL Link1; DatasheetVersion: Rev. B; ComponentLink3URL: http://www.analog.com/static/imported-files/packages/PKG_PDF/SOIC_WIDE%20%28RW%29/RW_16.pdf; ComponentLink3Description: Package Specification; Mounting Technology: Surface Mount; ComponentLink2Description: Datasheet
R701 R702 = gen_R_1k5_0603: SMD Resistor 1k5 0603; Tolerance: 1%; Power: 0.1W; Case EIA: 0603; Case Metric: 1608; Maximum Working Voltage: 75V; PnP Package: R_0603; Automotive Qualified: False; Part Number: gen_R_1k5_0603; Operating Temperature: -55°C - +155°C; Resistance: 1k5; Series: E24, E96; PnP Value: 1k5; Supplier 1: Farnell; Supplier Part Number 1: 2616745
R703 R704 = gen_R_680R_0603: as R404 on sheet mcu0_primary; Part Number: gen_R_680R_0603; Operating Temperature: -55°C - +155°C; Resistance: 680R; Series: E24; PnP Value: 680R; Supplier 1: Farnell; Supplier Part Number 1: 2797303
R705 = gen_R_0R_0603: as R403 on sheet mcu0_primary; Part Number: gen_R_0R_0603; Operating Temperature: -55°C - +155°C; Resistance: 0R; Series: Jumper; PnP Value: 0R; Supplier 1: Farnell; Supplier Part Number 1: 2073345
R706 = gen_R_10R_0603: as R806 on sheet CAN0; Part Number: gen_R_10R_0603; Operating Temperature: -55°C - +155°C; Resistance: 10R; Series: E24, E96; PnP Value: 10R; Supplier 1: Farnell; Supplier Part Number 1: 2073361
R707-R710 = gen_R_10k_0603: as R405 on sheet mcu0_primary; Part Number: gen_R_10k_0603; Operating Temperature: -55°C - +155°C; Resistance: 10k; Series: E24, E96; PnP Value: 10k; Supplier 1: Farnell; Supplier Part Number 1: 2073349
T701 = IRLML0100TRPBF: as T801 on sheet CAN0; Part Number: IRLML0100TRPBF; Part Name: NMOS; Operating Temperature: -55°C - +150°C; ComponentLink1Description: Datasheet URL; ComponentLink1URL: http://www.farnell.com/datasheets/491501.pdf; Supplier 1: Farnell; Supplier Part Number 1: 1783928
X701 = molex_microfit_3_02x2_THT: as X801 on sheet CAN0; Part Number: molex_microfit_3_02x2_THT; Part Name: MicroFit; Operating Temperature: -40°C - +105°C; Supplier 1: Farnell; Supplier Part Number 1: 9733019

## Sheet isolated_USB.SchDoc: foxBMS BMS-Master
size A3; DocumentNumber: 19; SheetNumber: 19; SheetTotal: 24; Author: Fraunhofer IISB foxBMS Team; REL-DATE: 2017-05-16; VERSION: 1.0.2; SheetDescription: Isolated USB MCU_0 + MCU_1
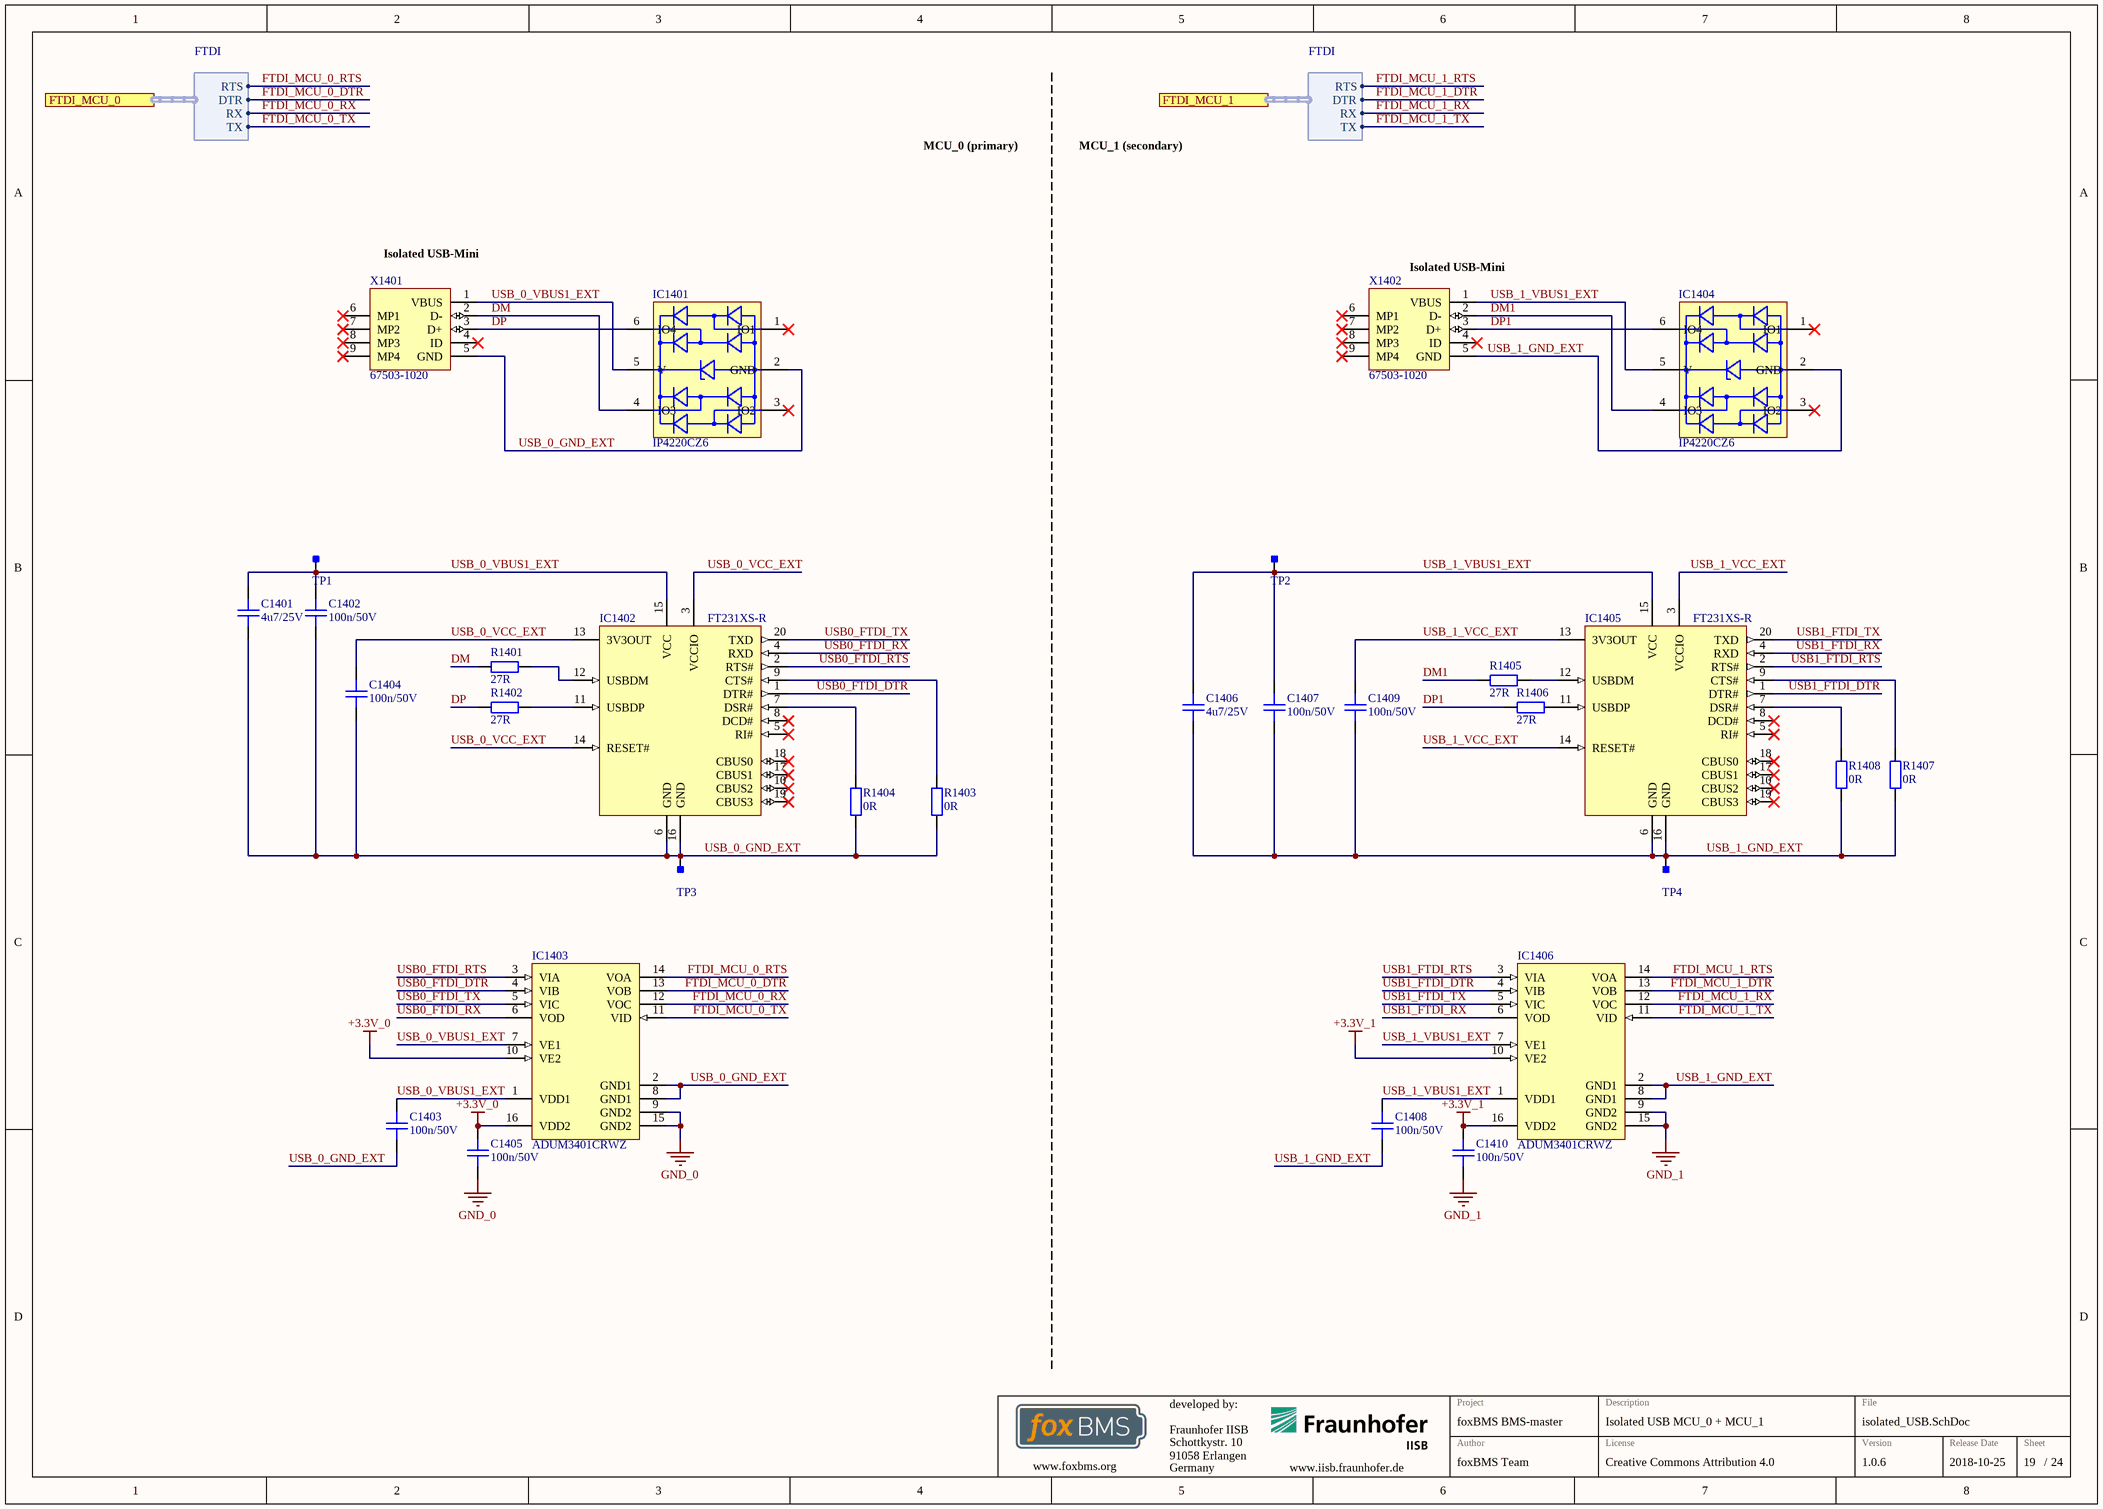
[diagram p15: isolated_USB.SchDoc]

### Parts
C1401  4u7/25V  [CAPC1608X08N]
C1402  100n/50V  [CAPC1608X08N]
C1403  100n/50V  [CAPC1608X08N]
C1404  100n/50V  [CAPC1608X08N]
C1405  100n/50V  [CAPC1608X08N]
C1406  4u7/25V  [CAPC1608X08N]
C1407  100n/50V  [CAPC1608X08N]
C1408  100n/50V  [CAPC1608X08N]
C1409  100n/50V  [CAPC1608X08N]
C1410  100n/50V  [CAPC1608X08N]
IC1401  IP4220CZ6  [TSOP95P280X110-6N]
IC1402  FT231XS-R  [SSOP-20_L]
IC1403  ADUM3401CRWZ  [ADI-RW-16_N]
IC1404  IP4220CZ6  [TSOP95P280X110-6N]
IC1405  FT231XS-R  [SSOP-20_L]
IC1406  ADUM3401CRWZ  [ADI-RW-16_N]
R1401  27R  [RESC1608X05N]
R1402  27R  [RESC1608X05N]
R1403  0R  [RESC1608X05N]
R1404  0R  [RESC1608X05N]
R1405  27R  [RESC1608X05N]
R1406  27R  [RESC1608X05N]
R1407  0R  [RESC1608X05N]
R1408  0R  [RESC1608X05N]
TP1  Testpoint_Square  [Testpoint_S1]  (value not drawn)  (no BOM)
TP2  Testpoint_Square  [Testpoint_S1]  (value not drawn)  (no BOM)
TP3  Testpoint_Square  [Testpoint_S1]  (value not drawn)  (no BOM)
TP4  Testpoint_Square  [Testpoint_S1]  (value not drawn)  (no BOM)
X1401  67503-1020  [MOLX-67503-1020_V]
X1402  67503-1020  [MOLX-67503-1020_V]

### Ports
FTDI_MCU_0 (harness FTDI), FTDI_MCU_1 (harness FTDI)

### Harnesses
FTDI: RTS, DTR, RX, TX

### Nets
+3.3V_0: C1405.1 IC1403.10(VE2) IC1403.16(VDD2)
+3.3V_1: C1410.1 IC1406.10(VE2) IC1406.16(VDD2)
GND_0: C1405.2 IC1403.9(GND2) IC1403.15(GND2)
GND_1: C1410.2 IC1406.9(GND2) IC1406.15(GND2)
DM: IC1401.4(IO3) R1401.2 X1401.2(D-)
DM1: IC1404.4(IO3) R1405.2 X1402.2(D-)
DP: IC1401.6(IO4) R1402.2 X1401.3(D+)
DP1: IC1404.6(IO4) R1406.2 X1402.3(D+)
FTDI_MCU_0_DTR: IC1403.13(VOB) ; port FTDI_MCU_0.DTR
FTDI_MCU_0_RTS: IC1403.14(VOA) ; port FTDI_MCU_0.RTS
FTDI_MCU_0_RX: IC1403.12(VOC) ; port FTDI_MCU_0.RX
FTDI_MCU_0_TX: IC1403.11(VID) ; port FTDI_MCU_0.TX
FTDI_MCU_1_DTR: IC1406.13(VOB) ; port FTDI_MCU_1.DTR
FTDI_MCU_1_RTS: IC1406.14(VOA) ; port FTDI_MCU_1.RTS
FTDI_MCU_1_RX: IC1406.12(VOC) ; port FTDI_MCU_1.RX
FTDI_MCU_1_TX: IC1406.11(VID) ; port FTDI_MCU_1.TX
USB0_FTDI_DTR: IC1402.1(DTR#) IC1403.4(VIB)
USB0_FTDI_RTS: IC1402.2(RTS#) IC1403.3(VIA)
USB0_FTDI_RX: IC1402.4(RXD) IC1403.6(VOD)
USB0_FTDI_TX: IC1402.20(TXD) IC1403.5(VIC)
USB1_FTDI_DTR: IC1405.1(DTR#) IC1406.4(VIB)
USB1_FTDI_RTS: IC1405.2(RTS#) IC1406.3(VIA)
USB1_FTDI_RX: IC1405.4(RXD) IC1406.6(VOD)
USB1_FTDI_TX: IC1405.20(TXD) IC1406.5(VIC)
USB_0_GND_EXT: C1401.2 C1402.2 C1403.2 C1404.2 IC1401.2(GND) IC1402.6(GND) IC1402.16(GND) IC1403.2(GND1) IC1403.8(GND1) R1403.2 R1404.2 TP3.1 X1401.5(GND)
USB_0_VBUS1_EXT: C1401.1 C1402.1 C1403.1 IC1401.5(V) IC1402.15(VCC) IC1403.1(VDD1) IC1403.7(VE1) TP1.1 X1401.1(VBUS)
USB_0_VCC_EXT: C1404.1 IC1402.3(VCCIO) IC1402.13(3V3OUT) IC1402.14(RESET#)
USB_1_GND_EXT: C1406.2 C1407.2 C1408.2 C1409.2 IC1404.2(GND) IC1405.6(GND) IC1405.16(GND) IC1406.2(GND1) IC1406.8(GND1) R1407.2 R1408.2 TP4.1 X1402.5(GND)
USB_1_VBUS1_EXT: C1406.1 C1407.1 C1408.1 IC1404.5(V) IC1405.15(VCC) IC1406.1(VDD1) IC1406.7(VE1) TP2.1 X1402.1(VBUS)
USB_1_VCC_EXT: C1409.1 IC1405.3(VCCIO) IC1405.13(3V3OUT) IC1405.14(RESET#)
NetIC1402_7: IC1402.7(DSR#) R1404.1
NetIC1402_9: IC1402.9(CTS#) R1403.1
NetIC1402_11: IC1402.11(USBDP) R1402.1
NetIC1402_12: IC1402.12(USBDM) R1401.1
NetIC1405_7: IC1405.7(DSR#) R1408.1
NetIC1405_9: IC1405.9(CTS#) R1407.1
NetIC1405_11: IC1405.11(USBDP) R1406.1
NetIC1405_12: IC1405.12(USBDM) R1405.1

Not connected (* = marked no-connect by the designer): IC1401 1(IO1)* 3(IO2)*; IC1402 5(RI#)* 8(DCD#)* 10(CBUS2)* 17(CBUS1)* 18(CBUS0)* 19(CBUS3)*; IC1404 1(IO1)* 3(IO2)*; IC1405 5(RI#)* 8(DCD#)* 10(CBUS2)* 17(CBUS1)* 18(CBUS0)* 19(CBUS3)*; X1401 4(ID)* 6(MP1)* 7(MP2)* 8(MP3)* 9(MP4)*; X1402 4(ID)* 6(MP1)* 7(MP2)* 8(MP3)* 9(MP4)*

### Notes on the sheet
- MCU_0 (primary)
- MCU_1 (secondary)
- (near X1401) Isolated USB-Mini
- (near X1402) Isolated USB-Mini
- Fraunhofer IISB
- Schottkystr. 10
- developed by:
- 91058 Erlangen
- Germany
- Author
- Project
- License
- Description
- File
- Version
- Release Date
- Sheet
- www.foxbms.org
- www.iisb.fraunhofer.de
- foxBMS Team
- /

### Library data of the parts
C1401 C1406 = gen_C_ceramic_4u7_25V_X5R_0603: MLCC; Capacitance: 4u7; Rated Voltage: 25V; Dielectric: X5R; Case EIA: 0603; Case Metric: 1608; AVT Set: x; Automotive Qualified: False; Part Number: gen_C_ceramic_4u7_25V_X5R_0603; Supplier 1: Farnell; Supplier Part Number 1: 2672159
C1402-C1405 C1407-C1410 = gen_C_ceramic_100n_50V_X7R_0603: MLCC; Capacitance: 100n; Rated Voltage: 50V; Dielectric: X7R; Case EIA: 0603; Case Metric: 1608; PnP Package: C_0603_10; PnP Value: 100n/50V/X7R; PnP equipped: x; Automotive Qualified: False; Part Number: gen_C_ceramic_100n_50V_X7R_0603; Supplier 1: Farnell; Supplier Part Number 1: 2525267; Supplier 2: Digikey; Supplier Part Number 2: 490-6049-1-ND
IC1401 IC1404 = nxp_IP4220CZ6,125
IP4220CZ6,125: Usb ESD protection diodes; Manufacturer: Nexperia; PnP Package: SOT457; Automotive Qualified: False; Part Number: nxp_IP4220CZ6,125 / IP4220CZ6,125; Part Name: IP4220CZ6,125; Operating Temperature: -40°C - +85°C; ComponentLink1Description: Datasheet; ComponentLink1URL: http://www.farnell.com/datasheets/1708221.pdf; Supplier 1: Farnell; Supplier Part Number 1: 1506629; Supplier 2: Digikey; Supplier Part Number 2: 1727-3578-1-ND; Supplier 3: Mouser; Supplier Part Number 3: 771-IP4220CZ6-T/R
IC1402 IC1405 = CMP-0248-00024-2: USB to Full-Handshake UART Interface Chip, UHCI/OHCI/EHCI Compatible, USB 2.0 Compatible, -40 to +85 degC, 20-Pin SSOP, Pb-Free, Tape and Reel; Manufacturer: FTDI; PackageVersion: Feb-13; PackageReference: SSOP-20; ComponentLink1Description: Manufacturer URL; ComponentLink2Description: Datasheet; PackageDescription: 20-Pin Small Outline Package, 8.6 x 3.9 mm Body, 0.635 mm Pitch; ComponentLink3URL: www.ftdichip.com/Products/ICs/FT231X.html; PartNumber: FT231XS-R; DatasheetVersion: ver 1.2, Feb-2013; ComponentLink2URL: http://www.ftdichip.com/Support/Documents/DataSheets/ICs/DS_FT231X.pdf; Code_JEDEC: MO-137-AD; ComponentLink3Description: FT231X Product Page; RevisionNote: DatasheetVersion updated to 1.2 Feb-2013; ComponentLink1URL: http://www.ftdichip.com/
IC1403 IC1406 = CMP-0534-00405-1: Quad Channel Digital Isolator, Enhanced System-Level ESD Reliability, 2.5 KV rms Insulation Rating, 90 Mbps Data Rate, 32 ns Delay, Industrial, 16-pin SOIC (RW-16), Tube; Manufacturer: Analog Devices; Insulation Rating (kVrms): 2.5; Max Data Rate: 90Mbps; PackageDescription: 16-Pin Standard Small Outline Package, Body 10.3 x 7.5 mm, Pitch 1.27 mm; ComponentLink2Description: Datasheet; Mounting Technology: Surface Mount; ComponentLink2URL: http://www.analog.com/static/imported-files/data_sheets/ADUM3400_3401_3402.pdf; ComponentLink4URL: Product URL:http://www.analog.com/en/interface-isolation/digital-isolators/adum3401/products/product.html; ComponentLink1URL: http://www.analog.com/en/index.html; ComponentLink1Description: Manufacturer URL; Max Operating Temp (degreesC): 105; PartNumber: ADUM3401CRWZ; Code_JEDEC: MS-013-AA; PackageVersion: 032707-B, 03/2007; ComponentLink3URL: http://www.analog.com/static/imported-files/packages/PKG_PDF/SOIC_WIDE%20%28RW%29/RW_16.pdf; DatasheetVersion: Rev. B; PackageReference: RW-16; ComponentLink4Description: URL Link1; ComponentLink3Description: Package Specification
R1401 R1402 R1405 R1406 = gen_R_27R_0603: SMD Resistor 27R 0603; Tolerance: 1%; Power: 0.1W; Case EIA: 0603; Case Metric: 1608; Maximum Working Voltage: 75V; PnP Package: R_0603; Automotive Qualified: False; Part Number: gen_R_27R_0603; Operating Temperature: -55°C - +155°C; Resistance: 27R; Series: E24; PnP Value: 27R; Supplier 1: Farnell; Supplier Part Number 1: 2059559
R1403 R1404 = gen_R_0R_0603: SMD Resistor 0R 0603; Power: 0.1W; Case EIA: 0603; Case Metric: 1608; PnP Package: R_0603; Maximum Working Voltage: 75V; Automotive Qualified: False; Part Number: gen_R_0R_0603; Operating Temperature: -55°C - +155°C; Resistance: 0R; Series: Jumper; PnP Value: 0R; Supplier 1: Farnell; Supplier Part Number 1: 2073345
R1407 R1408 = gen_R_0R_0603: SMD Resistor 0R 0603; Power: 0.1W; Case EIA: 0603; Case Metric: 1608; Maximum Working Voltage: 75V; PnP Package: R_0603; Automotive Qualified: False; Part Number: gen_R_0R_0603; Operating Temperature: -55°C - +155°C; Resistance: 0R; Series: Jumper; PnP Value: 0R; Supplier 1: Farnell; Supplier Part Number 1: 2073345
TP1-TP4 = Testpoint_Square: Testpoint, square; Part Number: Testpoint_Square
X1401 X1402 = CMP-0411-00002-1: USB, MINI, SMD, RA KME04-USBMU03A01; Manufacturer: Molex; ComponentLink1URL: http://www.molex.com/; PartNumber: 67503-1020; Mounting Technology: Surface Mount; ComponentLink1Description: Manufacturer URL; Terminal Pitch: 0.8 mm; DatasheetVersion: Rev F, 06/2009; ComponentLink2Description: Datasheet; PackageDescription: Mini USB Connector, SMT, Righer Angle; ComponentLink2URL: http://www.molex.com/pdm_docs/sd/675031020_sd.pdf; PackageReference: 67503-1020

## Sheet mcu1_secondary.SchDoc: foxBMS BMS-Master
size A3; DocumentNumber: 11; SheetNumber: 11; SheetTotal: 24; Author: Fraunhofer IISB foxBMS Team; REL-DATE: 2017-05-16; VERSION: 1.0.2; SheetDescription: MCU1 (Secondary)
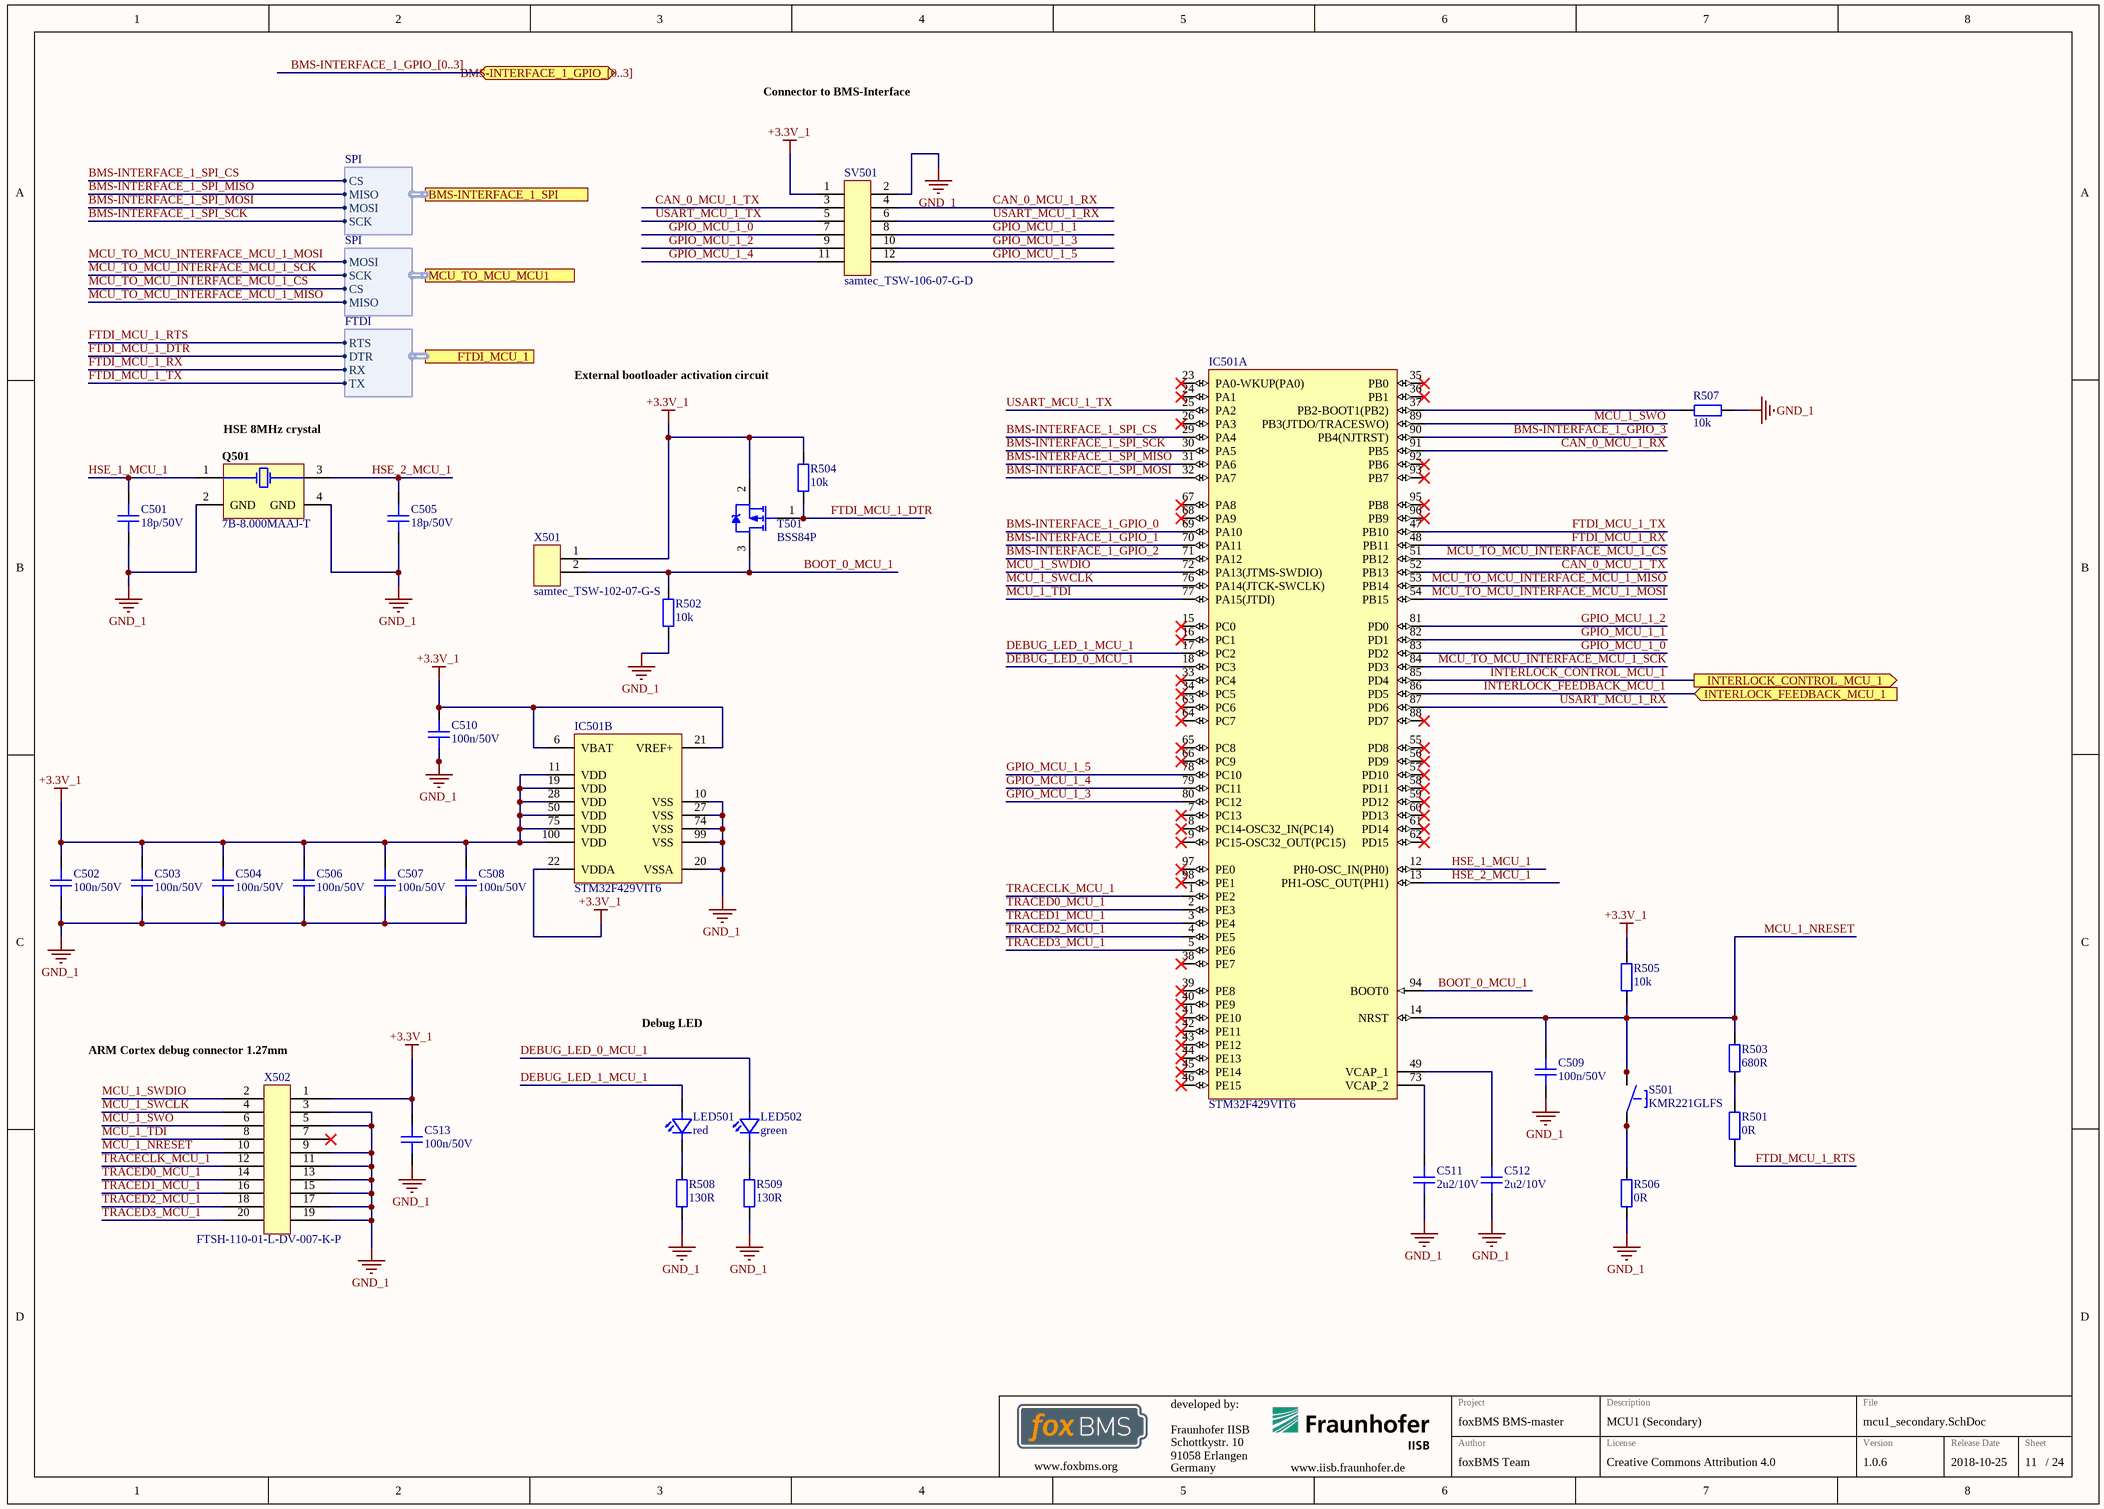
[diagram p16: mcu1_secondary.SchDoc]

### Parts
C501  18p/50V  [CAPC1608X08N]
C502  100n/50V  [CAPC1608X08N]
C503  100n/50V  [CAPC1608X08N]
C504  100n/50V  [CAPC1608X08N]
C505  18p/50V  [CAPC1608X08N]
C506  100n/50V  [CAPC1608X08N]
C507  100n/50V  [CAPC1608X08N]
C508  100n/50V  [CAPC1608X08N]
C509  100n/50V  [CAPC1608X08N]
C510  100n/50V  [CAPC1608X08N]
C511  2u2/10V  [CAPC1608X08N]
C512  2u2/10V  [CAPC1608X08N]
C513  100n/50V  [CAPC1608X08N]
IC501  STM32F429VIT6  [STM-LQFP100_N]  (parts A,B of 2)
LED501  red  [LEDC1608X07N]
LED502  green  [LEDC1608X07N]
Q501  7B-8.000MAAJ-T  [TXC-7B-4_V]
R501  0R  [RESC1608X05N]
R502  10k  [RESC1608X05N]
R503  680R  [RESC1608X05N]
R504  10k  [RESC1608X05N]
R505  10k  [RESC1608X05N]
R506  0R  [RESC1608X05N]
R507  10k  [RESC1608X05N]
R508  130R  [RESC1608X05N]
R509  130R  [RESC1608X05N]
S501  KMR221GLFS  [KMR2_Series]
SV501  samtec_TSW-106-07-G-D  [Pinheader_2.54_2x6]
T501  BSS84P  [INF-PG-SOT23_N]
X501  samtec_TSW-102-07-G-S  [Pinheader_2.54_2]
X502  FTSH-110-01-L-DV-007-K-P  [CORTEX_DEBUG_20_PIN]

### Ports
BMS-INTERFACE_1_GPIO_[0..3] (bidir), BMS-INTERFACE_1_SPI (harness SPI), FTDI_MCU_1 (harness FTDI), INTERLOCK_CONTROL_MCU_1 (out), INTERLOCK_FEEDBACK_MCU_1 (in), MCU_TO_MCU_MCU1 (harness SPI)

### Harnesses
SPI: CS, MISO, MOSI, SCK
FTDI: RTS, DTR, RX, TX

### Nets
+3.3V_1: C502.1 C503.1 C504.1 C506.1 C507.1 C508.1 C510.1 C513.1 IC501.6(VBAT) IC501.11(VDD) IC501.19(VDD) IC501.21(VREF+) IC501.22(VDDA) IC501.28(VDD) IC501.50(VDD) IC501.75(VDD) IC501.100(VDD) R504.2 R505.2 SV501.1 T501.2(SOURCE) X501.1 X502.1
GND_1: C501.1 C502.2 C503.2 C504.2 C505.2 C506.2 C507.2 C508.2 C509.2 C510.2 C511.2 C512.2 C513.2 IC501.10(VSS) IC501.20(VSSA) IC501.27(VSS) IC501.74(VSS) IC501.99(VSS) Q501.2(GND) Q501.4(GND) R502.1 R506.1 R507.1 R508.1 R509.1 SV501.2 X502.3 X502.5 X502.9 X502.11 X502.13 X502.15 X502.17 X502.19
BMS-INTERFACE_1_GPIO_0: IC501.69(PA10)
BMS-INTERFACE_1_GPIO_1: IC501.70(PA11)
BMS-INTERFACE_1_GPIO_2: IC501.71(PA12)
BMS-INTERFACE_1_GPIO_3: IC501.90(PB4(NJTRST))
BMS-INTERFACE_1_SPI_CS: IC501.29(PA4) ; port BMS-INTERFACE_1_SPI.CS
BMS-INTERFACE_1_SPI_MISO: IC501.31(PA6) ; port BMS-INTERFACE_1_SPI.MISO
BMS-INTERFACE_1_SPI_MOSI: IC501.32(PA7) ; port BMS-INTERFACE_1_SPI.MOSI
BMS-INTERFACE_1_SPI_SCK: IC501.30(PA5) ; port BMS-INTERFACE_1_SPI.SCK
BOOT_0_MCU_1: IC501.94(BOOT0) R502.2 T501.3(DRAIN) X501.2
CAN_0_MCU_1_RX: IC501.91(PB5) SV501.4
CAN_0_MCU_1_TX: IC501.52(PB13) SV501.3
DEBUG_LED_0_MCU_1: IC501.18(PC3) LED502.2(A)
DEBUG_LED_1_MCU_1: IC501.17(PC2) LED501.2(A)
FTDI_MCU_1_DTR: R504.1 T501.1(GATE) ; port FTDI_MCU_1.DTR
FTDI_MCU_1_RTS: R501.2 ; port FTDI_MCU_1.RTS
FTDI_MCU_1_RX: IC501.48(PB11) ; port FTDI_MCU_1.RX
FTDI_MCU_1_TX: IC501.47(PB10) ; port FTDI_MCU_1.TX
GPIO_MCU_1_0: IC501.83(PD2) SV501.7
GPIO_MCU_1_1: IC501.82(PD1) SV501.8
GPIO_MCU_1_2: IC501.81(PD0) SV501.9
GPIO_MCU_1_3: IC501.80(PC12) SV501.10
GPIO_MCU_1_4: IC501.79(PC11) SV501.11
GPIO_MCU_1_5: IC501.78(PC10) SV501.12
HSE_1_MCU_1: C501.2 IC501.12(PH0-OSC_IN(PH0)) Q501.1(X1)
HSE_2_MCU_1: C505.1 IC501.13(PH1-OSC_OUT(PH1)) Q501.3(X2)
INTERLOCK_CONTROL_MCU_1: IC501.85(PD4) ; port INTERLOCK_CONTROL_MCU_1
INTERLOCK_FEEDBACK_MCU_1: IC501.86(PD5) ; port INTERLOCK_FEEDBACK_MCU_1
MCU_1_NRESET: C509.1 IC501.14(NRST) R503.1 R505.1 S501.3 S501.4 X502.10
MCU_1_SWCLK: IC501.76(PA14(JTCK-SWCLK)) X502.4
MCU_1_SWDIO: IC501.72(PA13(JTMS-SWDIO)) X502.2
MCU_1_SWO: IC501.89(PB3(JTDO/TRACESWO)) X502.6
MCU_1_TDI: IC501.77(PA15(JTDI)) X502.8
MCU_TO_MCU_INTERFACE_MCU_1_CS: IC501.51(PB12) ; port MCU_TO_MCU_MCU1.CS
MCU_TO_MCU_INTERFACE_MCU_1_MISO: IC501.53(PB14) ; port MCU_TO_MCU_MCU1.MISO
MCU_TO_MCU_INTERFACE_MCU_1_MOSI: IC501.54(PB15) ; port MCU_TO_MCU_MCU1.MOSI
MCU_TO_MCU_INTERFACE_MCU_1_SCK: IC501.84(PD3) ; port MCU_TO_MCU_MCU1.SCK
TRACECLK_MCU_1: IC501.1(PE2) X502.12
TRACED0_MCU_1: IC501.2(PE3) X502.14
TRACED1_MCU_1: IC501.3(PE4) X502.16
TRACED2_MCU_1: IC501.4(PE5) X502.18
TRACED3_MCU_1: IC501.5(PE6) X502.20
USART_MCU_1_RX: IC501.87(PD6) SV501.6
USART_MCU_1_TX: IC501.25(PA2) SV501.5
NetC511_1: C511.1 IC501.73(VCAP_2)
NetC512_1: C512.1 IC501.49(VCAP_1)
NetIC501_37: IC501.37(PB2-BOOT1(PB2)) R507.2
NetLED501_1: LED501.1(C) R508.2
NetLED502_1: LED502.1(C) R509.2
NetR501_1: R501.1 R503.2
NetR506_2: R506.2 S501.1 S501.2

Not connected (* = marked no-connect by the designer): IC501 7(PC13)* 8(PC14-OSC32_IN(PC14))* 9(PC15-OSC32_OUT(PC15))* 15(PC0)* 16(PC1)* 23(PA0-WKUP(PA0))* 24(PA1)* 26(PA3)* 33(PC4)* 34(PC5)* 35(PB0)* 36(PB1)* 38(PE7)* 39(PE8)* 40(PE9)* 41(PE10)* 42(PE11)* 43(PE12)* 44(PE13)* 45(PE14)* 46(PE15)* 55(PD8)* 56(PD9)* 57(PD10)* 58(PD11)* 59(PD12)* 60(PD13)* 61(PD14)* 62(PD15)* 63(PC6)* 64(PC7)* 65(PC8)* 66(PC9)* 67(PA8)* 68(PA9)* 88(PD7)* 92(PB6)* 93(PB7)* 95(PB8)* 96(PB9)* 97(PE0)* 98(PE1)*; X502 7*

### Buses and harness runs
bus BMS-INTERFACE_1_GPIO_[0..3] = port BMS-INTERFACE_1_GPIO_[0..3]

### Notes on the sheet
- Connector to BMS-Interface
- External bootloader activation circuit
- (near Q501) HSE 8MHz crystal
- (near X502) ARM Cortex debug connector 1.27mm
- Debug LED
- Fraunhofer IISB
- Schottkystr. 10
- developed by:
- 91058 Erlangen
- Germany
- Author
- Project
- License
- Description
- File
- Version
- Release Date
- Sheet
- www.foxbms.org
- www.iisb.fraunhofer.de
- foxBMS Team
- /

### Library data of the parts
C501 C505 = gen_C_ceramic_18p_50V_C0G_0603: MLCC; Capacitance: 18p; Rated Voltage: 50V; Dielectric: C0G; Case EIA: 0603; Case Metric: 1608; Automotive Qualified: False; Part Number: gen_C_ceramic_18p_50V_C0G_0603; Supplier 1: Farnell; Supplier Part Number 1: 2070403
C502-C504 C506-C510 C513 = gen_C_ceramic_100n_50V_X7R_0603: as C1402-C1405 on sheet isolated_USB; Part Number: gen_C_ceramic_100n_50V_X7R_0603; Supplier 1: Farnell; Supplier Part Number 1: 2525267; Supplier 2: Digikey; Supplier Part Number 2: 490-6049-1-ND
C511 C512 = gen_C_ceramic_2u2_10V_X5R_0603: MLCC; Capacitance: 2u2; Rated Voltage: 10V; Dielectric: X5R; Case EIA: 0603; Case Metric: 1608; AVT Set: x; Automotive Qualified: False; Part Number: gen_C_ceramic_2u2_10V_X5R_0603; Supplier 1: Farnell; Supplier Part Number 1: 2320817
IC501 = CMP-0243-00030-2: ARM Cortex-M4 32-bit MCU+FPU, 225 DMIPS, 2048 kB Flash, 256 kB Internal RAM, 82 I/Os, 100-pin LQFP, -40 to 85 degC, Tray; Manufacturer: STMicroelectronics; FLASH Size (Prog) (kB): 2048; Supply Voltage(Vcc) min (V): 1.8; Operating Frequency(F) (Processor speed) (MHz): 180; Supply Voltage(Vcc) max (V): 3.6; D/A Converter: 2x12-bit; Internal RAM Size (kB): 256; I/Os (High Current): 82; Mounting Technology: Surface Mount; ComponentLink3URL: http://www.st.com/st-web-ui/static/active/en/resource/technical/document/data_brief/DM00071938.pdf; ComponentLink2URL: http://www.st.com/st-web-ui/static/active/en/resource/technical/document/data_brief/DM00053488.pdf; ComponentLink3Description: Package Specification; Packing: Tray; PackageDescription: 100-Pin Low Profile Quad Flat Package, 14 x 14 mm Body, 0.5 mm Pitch; PartNumber: STM32F429VIT6; ComponentLink2Description: Datasheet; ComponentLink1Description: Manufacturer URL; ComponentLink1URL: http://www.st.com/web/en/home.html; DatasheetVersion: Rev. 2; Core: ARM Cortex-M4; PackageReference: LQFP100; PackageVersion: Rev. 1, 06/2013
LED501 = gen_LED_0603_red: LED; Breakdown Voltage: 5V; Continuous Forward Current: 20mA; Forward Voltage @ 20mA: 2V; Automotive Qualified: False; Part Number: gen_LED_0603_red; Color: red; PnP Package: LED_0603; Supplier 1: Farnell; Supplier Part Number 1: 2099221
LED502 = gen_LED_0603_green: LED; Breakdown Voltage: 5V; Continuous Forward Current: 20mA; Forward Voltage @ 20mA: 2.2V; Automotive Qualified: False; Part Number: gen_LED_0603_green; Color: green; PnP Package: LED_0603; Supplier 1: Farnell; Supplier Part Number 1: 2099223
Q501 = CMP-1774-00004-1: SMD Seam Sealing Crystal, 8 MHz, +/- 30 ppm, 18 pF, -10 to 70 degC, 4-Pin SMD, RoHS, Tape and Reel; Power Rating: 100 mW; Case\Package: 0603; Voltage Rating: 50 V; Tolerance: 1%; Resistance: 150 Ohm; Package Quantity: 5000; Case Code (Metric): 1608; Packaging: Tape and Reel; Length: 1.6 mm; RoHSCompliant: true; REACH SVHC: No SVHC; Mount: Surface Mount; Case Code (Imperial): 0603; Pins: 2; Width: 0.8 mm; PackageDescription: 4-Pin Surface Mount Device, Body 5 x 3.2 mm, Pitch 3.7 mm; ComponentLink1Description: Datasheet; DatasheetVersion: Jul-15; ComponentLink1URL: http://www.txccorp.com/download/products/quartz_crystals/2015TXC_7B_19.pdf; PackageReference: 7B-4; Height: 0.45 mm; Max Operating Temperature: 155 degC; Min Operating Temperature: -55 degC; Voltage Rating (DC): 50 V
R501 R506 = gen_R_0R_0603: as R1403 on sheet isolated_USB; Part Number: gen_R_0R_0603; Operating Temperature: -55°C - +155°C; Resistance: 0R; Series: Jumper; PnP Value: 0R; Supplier 1: Farnell; Supplier Part Number 1: 2073345
R502 R504 R505 R507 = gen_R_10k_0603: SMD Resistor 10k 0603; Tolerance: 1%; Power: 0.1W; Case EIA: 0603; Case Metric: 1608; Maximum Working Voltage: 75V; PnP Package: R_0603; Automotive Qualified: False; Part Number: gen_R_10k_0603; Operating Temperature: -55°C - +155°C; Resistance: 10k; Series: E24, E96; PnP Value: 10k; Supplier 1: Farnell; Supplier Part Number 1: 2073349
R503 = gen_R_680R_0603: SMD Resistor 680R 0603; Tolerance: 1%; Power: 0.1W; Case EIA: 0603; Case Metric: 1608; Maximum Working Voltage: 75V; PnP Package: R_0603; Automotive Qualified: False; Part Number: gen_R_680R_0603; Operating Temperature: -55°C - +155°C; Resistance: 680R; Series: E24; PnP Value: 680R; Supplier 1: Farnell; Supplier Part Number 1: 2797303
R508 R509 = gen_R_130R_0603: SMD Resistor 130R 0603; Tolerance: 1%; Power: 0.1W; Case EIA: 0603; Case Metric: 1608; Maximum Working Voltage: 75V; PnP Package: R_0603; Automotive Qualified: False; Part Number: gen_R_130R_0603; Operating Temperature: -55°C - +155°C; Resistance: 130R; Series: E24, E96; PnP Value: 130R; Supplier 1: Farnell; Supplier Part Number 1: 2379959
S501 = KMR221GLFS: Microminiature Tactile Switch; Manufacturer: CK Components; Automotive Qualified: False; Part Number: KMR221GLFS; Operating Temperature: -40°C - +85°C; ComponentLink1Description: Datasheet; ComponentLink1URL: http://www.farnell.com/datasheets/1685525.pdf; Supplier 1: Farnell; Supplier Part Number 1: 1201424; Supplier 2: Digikey; Supplier Part Number 2: 401-1426-1-ND; Supplier 3: Mouser; Supplier Part Number 3: 611-KMR211G-LFS
SV501 = samtec_TSW-106-07-G-D: Board-To-Board Connector, Vertical, 2.54 mm, 12 Contacts, Header, TSW Series, Through Hole, 2 Rows; Manufacturer: Samtec; Circuits: 12; Rated Voltage: 500V AC mated with SSW; Automotive Qualified: False; Part Number: samtec_TSW-106-07-G-D; Part Name: TSW-106-07-G-D; Operating Temperature: -55°C - +125°C; ComponentLink1Description: Datasheet; ComponentLink1URL: http://www.farnell.com/datasheets/1992055.pdf?_ga=2.196729640.569325269.1503285096-1413671594.1503025027; Supplier 1: Farnell; Supplier Part Number 1: 2025252
T501 = CMP-1099-00028-1: P-Channel SIPMOS Small-Signal-Transistor, -60 V VDS, -0.17 A ID, -55 to 150 degC, PG-SOT23, Reel, Green; Manufacturer: Infineon; VGS(th) (max): -2Â V; VGS(th) (min): -1Â V; VDS (max): -60Â V; Rth: 350Â K/W; Pto t (max): 0.36Â W; ID (max): -0.17Â A; IDpuls (max): -0.68Â A; RDS (on) (max) (@4.5V): 12,000Â mOhm; QG: 1Â nC; Green: TRUE; RDS (on) (max): 8,000Â mOhm; ComponentLink3URL: http://www.infineon.com/dgdl/SOT23-Package_Overview.pdf?folderId=db3a30431936bc4b0119532290053c66&fileId=db3a30431936bc4b0119533468123c85; ComponentLink3Description: Package Specification; Packing: Reel; PartNumber: BSS84P; ComponentLink2Description: Datasheet; Mounting Technology: Surface Mount; ComponentLink2URL: http://www.infineon.com/dgdl/BSS84P_Rev2.7%5B1%5D.pdf?folderId=db3a304314dca38901154a72e3951a65&fileId=db3a304330f68606013118ac7a9b4549; PackageReference: PG-SOT23; ComponentLink1URL: http://www.infineon.com/; PackageVersion: Apr-08; ComponentLink1Description: Manufacturer URL; PackageDescription: 3-Pin Small Outline Transistor Package, 2.9 x 1.3 mm Body, 0.95 mm Pitch; Halogen-free: TRUE; DatasheetVersion: Rev. 2.7
X501 = samtec_TSW-102-07-G-S: Board-To-Board Connector, Vertical, 2.54 mm, 2 Contacts, Header, TSW Series, Through Hole, 1 Row; Manufacturer: Samtec; Circuits: 2; Automotive Qualified: False; Part Number: samtec_TSW-102-07-G-S; Part Name: TSW-102-07-G-S; Operating Temperature: -55°C - +125°C; ComponentLink1Description: Datasheet; ComponentLink1URL: http://www.farnell.com/datasheets/1796313.pdf; Supplier 1: Farnell; Supplier Part Number 1: 2505044
X502 = samtec_FTSH-110-01-L-DV-007-K-P: Board-To-Board Connector, ARM Cortex Debug Header 20 Pin; Manufacturer: Samtec; Circuits: 20; Automotive Qualified: False; Part Number: samtec_FTSH-110-01-L-DV-007-K-P; Part Name: FTSH-110-01-L-DV-007-K-P; Operating Temperature: -55°C - +125°C; Supplier 1: Digikey; Supplier Part Number 1: SAM11268-ND; Supplier 2: Avnet; Supplier Part Number 2: FTSH-110-01-L-DV-007-K-P